# Altium project copper_suicide.PrjPCB (part 2 of 5)

## Sheet fpga-bank1.SchDoc: Copper Suicide - FPGA - Bank 1
size Letter; CheckedBy: J. Brinton; CompanyName: Signal Laboratories, Inc.; DrawnBy: J. Brinton; Engineer: J. Brinton; Address1: 3479 Edison Way; Address2: Menlo Park CA 94025; Address3: +1 (877) 778-8435; Address4: siglabs.com; Revision: 3; SheetNumber: 6; SheetTotal: 47
Used 17 times, as channels FPGA01/FPGA1B, FPGA02/FPGA1B, FPGA03/FPGA1B, FPGA30/FPGA1B, FPGA31/FPGA1B, FPGA32/FPGA1B, FPGA33/FPGA1B, FPGA10/FPGA1B, FPGA11/FPGA1B, FPGA12/FPGA1B, FPGA13/FPGA1B, FPGA20/FPGA1B, FPGA21/FPGA1B, FPGA22/FPGA1B, FPGA23/FPGA1B, CFG/FPGA1B, FPGA00/FPGA1B. Parts and nets are listed once, with the designators drawn on the sheet.
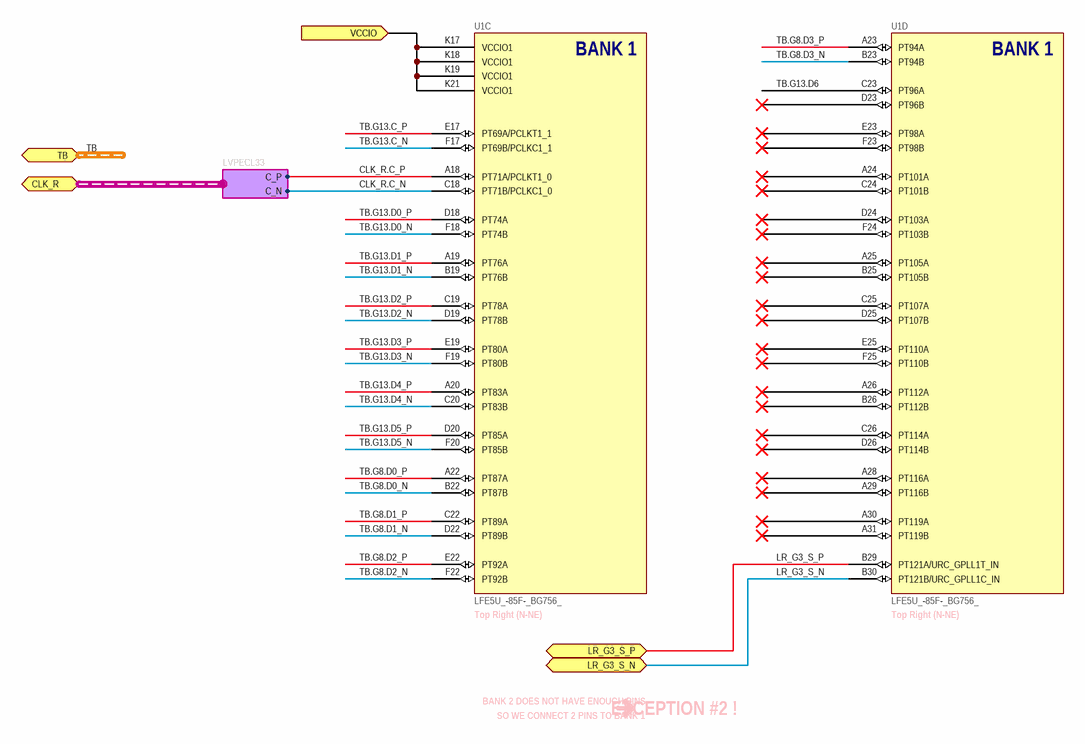
[diagram p3: fpga-bank1.SchDoc]

### Parts
U1  LFE5U_-85F-_BG756_  [caBGA756]  (parts C,D of 19)

### Ports
CLK_R (harness LVPECL33), LR_G3_S_N, LR_G3_S_P, TB (harness SDR), VCCIO (in)

### Harnesses
LVPECL33: C_P, C_N

### Nets
CLK_R.C_N: U1.C18(PT71B/PCLKC1_0) ; port CLK_R.C_N
CLK_R.C_P: U1.A18(PT71A/PCLKT1_0) ; port CLK_R.C_P
LR_G3_S_N: U1.B30(PT121B/URC_GPLL1C_IN) ; port LR_G3_S_N
LR_G3_S_P: U1.B29(PT121A/URC_GPLL1T_IN) ; port LR_G3_S_P
TB.G8.D0_N: U1.B22(PT87B)
TB.G8.D0_P: U1.A22(PT87A)
TB.G8.D1_N: U1.D22(PT89B)
TB.G8.D1_P: U1.C22(PT89A)
TB.G8.D2_N: U1.F22(PT92B)
TB.G8.D2_P: U1.E22(PT92A)
TB.G8.D3_N: U1.B23(PT94B)
TB.G8.D3_P: U1.A23(PT94A)
TB.G13.C_N: U1.F17(PT69B/PCLKC1_1)
TB.G13.C_P: U1.E17(PT69A/PCLKT1_1)
TB.G13.D0_N: U1.F18(PT74B)
TB.G13.D0_P: U1.D18(PT74A)
TB.G13.D1_N: U1.B19(PT76B)
TB.G13.D1_P: U1.A19(PT76A)
TB.G13.D2_N: U1.D19(PT78B)
TB.G13.D2_P: U1.C19(PT78A)
TB.G13.D3_N: U1.F19(PT80B)
TB.G13.D3_P: U1.E19(PT80A)
TB.G13.D4_N: U1.C20(PT83B)
TB.G13.D4_P: U1.A20(PT83A)
TB.G13.D5_N: U1.F20(PT85B)
TB.G13.D5_P: U1.D20(PT85A)
TB.G13.D6: U1.C23(PT96A)
VCCIO: U1.K17(VCCIO1) U1.K18(VCCIO1) U1.K19(VCCIO1) U1.K21(VCCIO1) ; port VCCIO

Not connected (* = marked no-connect by the designer): U1 A24(PT101A)* A25(PT105A)* A26(PT112A)* A28(PT116A)* A29(PT116B)* A30(PT119A)* A31(PT119B)* B25(PT105B)* B26(PT112B)* C24(PT101B)* C25(PT107A)* C26(PT114A)* D23(PT96B)* D24(PT103A)* D25(PT107B)* D26(PT114B)* E23(PT98A)* E25(PT110A)* F23(PT98B)* F24(PT103B)* F25(PT110B)*

### Channels
FPGA01/FPGA1B: designators end in A#2; ports LR_G3_S_N=IL12.LR.G3.S_N_FPGA01 LR_G3_S_P=IL12.LR.G3.S_P_FPGA01 VCCIO=IL12.VIOTB_FPGA01
FPGA02/FPGA1B: designators end in B#2; ports LR_G3_S_N=IL12.LR.G3.S_N_FPGA02 LR_G3_S_P=IL12.LR.G3.S_P_FPGA02 VCCIO=IL12.VIOTB_FPGA02
FPGA03/FPGA1B: designators end in C#2; ports LR_G3_S_N=IL12.LR.G3.S_N_FPGA03 LR_G3_S_P=IL12.LR.G3.S_P_FPGA03 VCCIO=IL12.VIOTB_FPGA03
FPGA30/FPGA1B: designators end in D#2; ports LR_G3_S_N=IL12.LR.G3.S_N_FPGA30 LR_G3_S_P=IL12.LR.G3.S_P_FPGA30 VCCIO=IL12.VIOTB_FPGA30
FPGA31/FPGA1B: designators end in E#2; ports LR_G3_S_N=IL12.LR.G3.S_N_FPGA31 LR_G3_S_P=IL12.LR.G3.S_P_FPGA31 VCCIO=IL12.VIOTB_FPGA31
FPGA32/FPGA1B: designators end in F#2; ports LR_G3_S_N=IL12.LR.G3.S_N_FPGA32 LR_G3_S_P=IL12.LR.G3.S_P_FPGA32 VCCIO=IL12.VIOTB_FPGA32
FPGA33/FPGA1B: designators end in G#2; ports LR_G3_S_N=IL12.LR.G3.S_N_FPGA33 LR_G3_S_P=IL12.LR.G3.S_P_FPGA33 VCCIO=IL12.VIOTB_FPGA33
FPGA10/FPGA1B: designators end in H#2; ports LR_G3_S_N=IL12.LR.G3.S_N_FPGA10 LR_G3_S_P=IL12.LR.G3.S_P_FPGA10 VCCIO=IL12.VIOTB_FPGA10
FPGA11/FPGA1B: designators end in I#2; ports LR_G3_S_N=IL12.LR.G3.S_N_FPGA11 LR_G3_S_P=IL12.LR.G3.S_P_FPGA11 VCCIO=IL12.VIOTB_FPGA11
FPGA12/FPGA1B: designators end in J#2; ports LR_G3_S_N=IL12.LR.G3.S_N_FPGA12 LR_G3_S_P=IL12.LR.G3.S_P_FPGA12 VCCIO=IL12.VIOTB_FPGA12
FPGA13/FPGA1B: designators end in K#2; ports LR_G3_S_N=IL12.LR.G3.S_N_FPGA13 LR_G3_S_P=IL12.LR.G3.S_P_FPGA13 VCCIO=IL12.VIOTB_FPGA13
FPGA20/FPGA1B: designators end in L#2; ports LR_G3_S_N=IL12.LR.G3.S_N_FPGA20 LR_G3_S_P=IL12.LR.G3.S_P_FPGA20 VCCIO=IL12.VIOTB_FPGA20
FPGA21/FPGA1B: designators end in M#2; ports LR_G3_S_N=IL12.LR.G3.S_N_FPGA21 LR_G3_S_P=IL12.LR.G3.S_P_FPGA21 VCCIO=IL12.VIOTB_FPGA21
FPGA22/FPGA1B: designators end in N#2; ports LR_G3_S_N=IL12.LR.G3.S_N_FPGA22 LR_G3_S_P=IL12.LR.G3.S_P_FPGA22 VCCIO=IL12.VIOTB_FPGA22
FPGA23/FPGA1B: designators end in O#2; ports LR_G3_S_N=IL12.LR.G3.S_N_FPGA23 LR_G3_S_P=IL12.LR.G3.S_P_FPGA23 VCCIO=IL12.VIOTB_FPGA23
CFG/FPGA1B: designators end in P#2; ports LR_G3_S_N=IL12.LR.G3.S_N_CFG LR_G3_S_P=IL12.LR.G3.S_P_CFG VCCIO=IL12.VIOTB_CFG
FPGA00/FPGA1B: designators end in Q#2; ports LR_G3_S_N=IL12.LR.G3.S_N_FPGA00 LR_G3_S_P=IL12.LR.G3.S_P_FPGA00 VCCIO=IL12.VIOTB_FPGA00

### Buses and harness runs
harness TB = port TB

### Notes on the sheet
- (near U1) Top Right (N-NE)
- EXCEPTION #2 !
- BANK 2 DOES NOT HAVE ENOUGH PINS
- SO WE CONNECT 2 PINS TO BANK 1
- Title
- Engineer
- Revision
- Drawn By
- Checked By
- Date
- Sheet
- of
- (in symbol LFE5U_-85F-_BG756_, part C) BANK 1
- (in symbol LFE5U_-85F-_BG756_, part D) BANK 1

### Library data of the parts
U1 = LFE5U_-85F-_BG756_: ECP5 FPGA, 85k LUT, 756-caBGA; Manufacturer: Lattice Semiconductor; Manufacturer P/N: LFE5U_-85F-_BG756_

## Sheet fpga-bank2.SchDoc: Copper Suicide - FPGA - Bank 2
size Letter; CheckedBy: J. Brinton; CompanyName: Signal Laboratories, Inc.; DrawnBy: J. Brinton; Engineer: J. Brinton; Address1: 3479 Edison Way; Address2: Menlo Park CA 94025; Address3: +1 (877) 778-8435; Address4: siglabs.com; Revision: 3; SheetNumber: 7; SheetTotal: 47
Used 17 times, as channels FPGA01/FPGA2B, FPGA02/FPGA2B, FPGA03/FPGA2B, FPGA30/FPGA2B, FPGA31/FPGA2B, FPGA32/FPGA2B, FPGA33/FPGA2B, FPGA10/FPGA2B, FPGA11/FPGA2B, FPGA12/FPGA2B, FPGA13/FPGA2B, FPGA20/FPGA2B, FPGA21/FPGA2B, FPGA22/FPGA2B, FPGA23/FPGA2B, CFG/FPGA2B, FPGA00/FPGA2B. Parts and nets are listed once, with the designators drawn on the sheet.
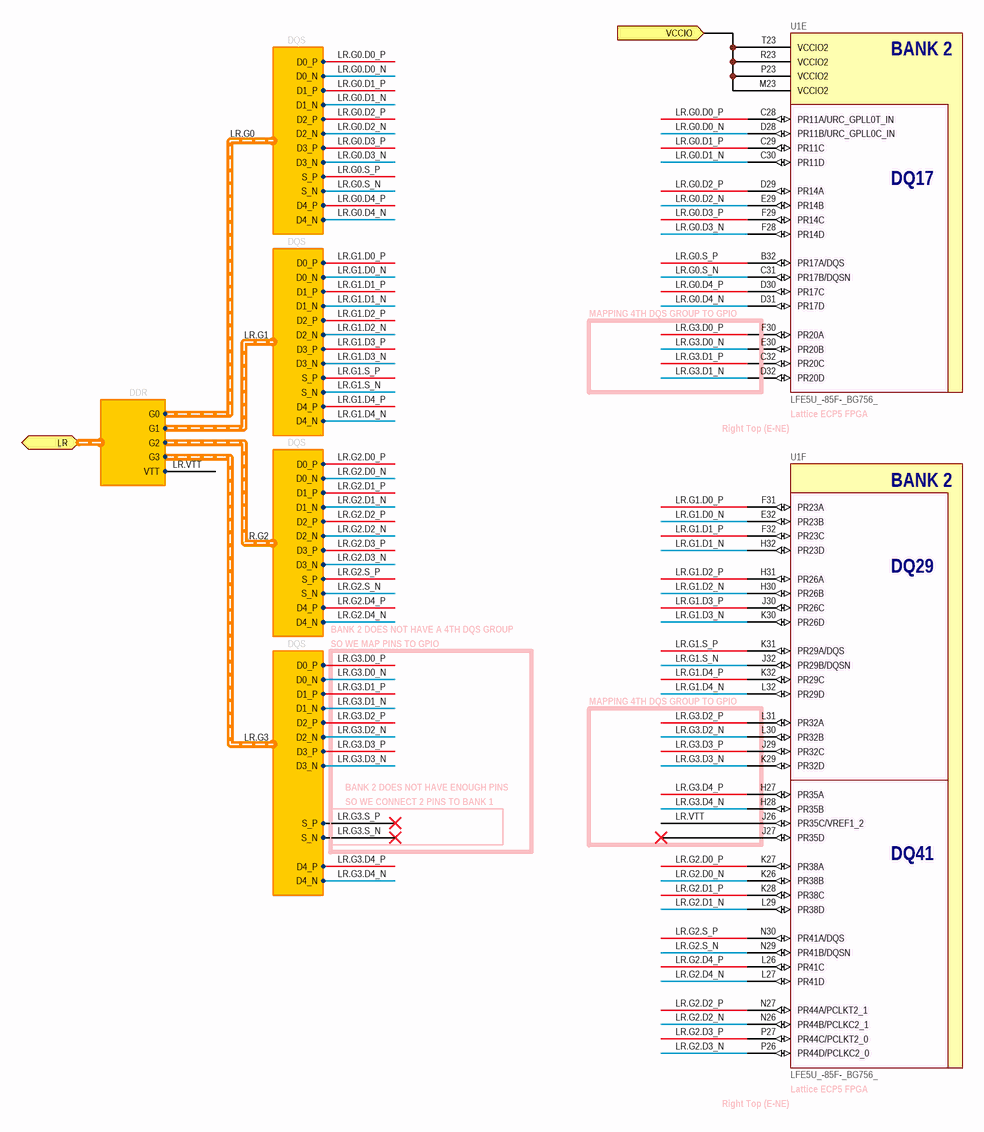
[diagram p4: fpga-bank2.SchDoc]

### Parts
U1  LFE5U_-85F-_BG756_  [caBGA756]  (parts E,F of 19)

### Ports
LR (harness DDR), VCCIO (in)

### Harnesses
DQS: D0_P, D0_N, D1_P, D1_N, D2_P, D2_N, D3_P, D3_N, D4_P, D4_N, S_P, S_N
DDR: G0, G1, G2, G3, VTT

### Nets
LR.G0.D0_N: U1.D28(PR11B/URC_GPLL0C_IN) ; harness DQS.D0_N
LR.G0.D0_P: U1.C28(PR11A/URC_GPLL0T_IN) ; harness DQS.D0_P
LR.G0.D1_N: U1.C30(PR11D) ; harness DQS.D1_N
LR.G0.D1_P: U1.C29(PR11C) ; harness DQS.D1_P
LR.G0.D2_N: U1.E29(PR14B) ; harness DQS.D2_N
LR.G0.D2_P: U1.D29(PR14A) ; harness DQS.D2_P
LR.G0.D3_N: U1.F28(PR14D) ; harness DQS.D3_N
LR.G0.D3_P: U1.F29(PR14C) ; harness DQS.D3_P
LR.G0.D4_N: U1.D31(PR17D) ; harness DQS.D4_N
LR.G0.D4_P: U1.D30(PR17C) ; harness DQS.D4_P
LR.G0.S_N: U1.C31(PR17B/DQSN) ; harness DQS.S_N
LR.G0.S_P: U1.B32(PR17A/DQS) ; harness DQS.S_P
LR.G1.D0_N: U1.E32(PR23B) ; harness DQS.D0_N
LR.G1.D0_P: U1.F31(PR23A) ; harness DQS.D0_P
LR.G1.D1_N: U1.H32(PR23D) ; harness DQS.D1_N
LR.G1.D1_P: U1.F32(PR23C) ; harness DQS.D1_P
LR.G1.D2_N: U1.H30(PR26B) ; harness DQS.D2_N
LR.G1.D2_P: U1.H31(PR26A) ; harness DQS.D2_P
LR.G1.D3_N: U1.K30(PR26D) ; harness DQS.D3_N
LR.G1.D3_P: U1.J30(PR26C) ; harness DQS.D3_P
LR.G1.D4_N: U1.L32(PR29D) ; harness DQS.D4_N
LR.G1.D4_P: U1.K32(PR29C) ; harness DQS.D4_P
LR.G1.S_N: U1.J32(PR29B/DQSN) ; harness DQS.S_N
LR.G1.S_P: U1.K31(PR29A/DQS) ; harness DQS.S_P
LR.G2.D0_N: U1.K26(PR38B) ; harness DQS.D0_N
LR.G2.D0_P: U1.K27(PR38A) ; harness DQS.D0_P
LR.G2.D1_N: U1.L29(PR38D) ; harness DQS.D1_N
LR.G2.D1_P: U1.K28(PR38C) ; harness DQS.D1_P
LR.G2.D2_N: U1.N26(PR44B/PCLKC2_1) ; harness DQS.D2_N
LR.G2.D2_P: U1.N27(PR44A/PCLKT2_1) ; harness DQS.D2_P
LR.G2.D3_N: U1.P26(PR44D/PCLKC2_0) ; harness DQS.D3_N
LR.G2.D3_P: U1.P27(PR44C/PCLKT2_0) ; harness DQS.D3_P
LR.G2.D4_N: U1.L27(PR41D) ; harness DQS.D4_N
LR.G2.D4_P: U1.L26(PR41C) ; harness DQS.D4_P
LR.G2.S_N: U1.N29(PR41B/DQSN) ; harness DQS.S_N
LR.G2.S_P: U1.N30(PR41A/DQS) ; harness DQS.S_P
LR.G3.D0_N: U1.E30(PR20B) ; harness DQS.D0_N
LR.G3.D0_P: U1.F30(PR20A) ; harness DQS.D0_P
LR.G3.D1_N: U1.D32(PR20D) ; harness DQS.D1_N
LR.G3.D1_P: U1.C32(PR20C) ; harness DQS.D1_P
LR.G3.D2_N: U1.L30(PR32B) ; harness DQS.D2_N
LR.G3.D2_P: U1.L31(PR32A) ; harness DQS.D2_P
LR.G3.D3_N: U1.K29(PR32D) ; harness DQS.D3_N
LR.G3.D3_P: U1.J29(PR32C) ; harness DQS.D3_P
LR.G3.D4_N: U1.H28(PR35B) ; harness DQS.D4_N
LR.G3.D4_P: U1.H27(PR35A) ; harness DQS.D4_P
LR.G3.S_N: harness DQS.S_N
LR.G3.S_P: harness DQS.S_P
LR.VTT: U1.J26(PR35C/VREF1_2) ; port LR.VTT
VCCIO: U1.M23(VCCIO2) U1.P23(VCCIO2) U1.R23(VCCIO2) U1.T23(VCCIO2) ; port VCCIO

Not connected (* = marked no-connect by the designer): U1 J27(PR35D)*

### Channels
FPGA01/FPGA2B: designators end in A#3; ports VCCIO=IL12.VIOLR_FPGA01
FPGA02/FPGA2B: designators end in B#3; ports VCCIO=IL12.VIOLR_FPGA02
FPGA03/FPGA2B: designators end in C#3; ports VCCIO=IL12.VIOLR_FPGA03
FPGA30/FPGA2B: designators end in D#3; ports VCCIO=IL12.VIOLR_FPGA30
FPGA31/FPGA2B: designators end in E#3; ports VCCIO=IL12.VIOLR_FPGA31
FPGA32/FPGA2B: designators end in F#3; ports VCCIO=IL12.VIOLR_FPGA32
FPGA33/FPGA2B: designators end in G#3; ports VCCIO=IL12.VIOLR_FPGA33
FPGA10/FPGA2B: designators end in H#3; ports VCCIO=IL12.VIOLR_FPGA10
FPGA11/FPGA2B: designators end in I#3; ports VCCIO=IL12.VIOLR_FPGA11
FPGA12/FPGA2B: designators end in J#3; ports VCCIO=IL12.VIOLR_FPGA12
FPGA13/FPGA2B: designators end in K#3; ports VCCIO=IL12.VIOLR_FPGA13
FPGA20/FPGA2B: designators end in L#3; ports VCCIO=IL12.VIOLR_FPGA20
FPGA21/FPGA2B: designators end in M#3; ports VCCIO=IL12.VIOLR_FPGA21
FPGA22/FPGA2B: designators end in N#3; ports VCCIO=IL12.VIOLR_FPGA22
FPGA23/FPGA2B: designators end in O#3; ports VCCIO=IL12.VIOLR_FPGA23
CFG/FPGA2B: designators end in P#3; ports VCCIO=IL12.VIOLR_CFG
FPGA00/FPGA2B: designators end in Q#3; ports VCCIO=IL12.VIOLR_FPGA00

### Notes on the sheet
- (near U1) MAPPING 4TH DQS GROUP TO GPIO
- (near U1) Right Top (E-NE)
- (near U1) Lattice ECP5 FPGA
- BANK 2 DOES NOT HAVE A 4TH DQS GROUP
- SO WE MAP PINS TO GPIO
- BANK 2 DOES NOT HAVE ENOUGH PINS
- SO WE CONNECT 2 PINS TO BANK 1
- Title
- Engineer
- Revision
- Drawn By
- Checked By
- Date
- Sheet
- of
- (in symbol LFE5U_-85F-_BG756_, part E) BANK 2; DQ17
- (in symbol LFE5U_-85F-_BG756_, part F) BANK 2; DQ29; DQ41

### Library data of the parts
U1 = LFE5U_-85F-_BG756_: as U1 on sheet fpga-bank1; Manufacturer P/N: LFE5U_-85F-_BG756_

## Sheet fpga-bank3.SchDoc: Copper Suicide - FPGA - Bank 3
size Letter; CheckedBy: J. Brinton; CompanyName: Signal Laboratories, Inc.; DrawnBy: J. Brinton; Engineer: J. Brinton; Address1: 3479 Edison Way; Address2: Menlo Park CA 94025; Address3: +1 (877) 778-8435; Address4: siglabs.com; Revision: 3; SheetNumber: 8; SheetTotal: 47
Used 17 times, as channels FPGA01/FPGA3B, FPGA02/FPGA3B, FPGA03/FPGA3B, FPGA30/FPGA3B, FPGA31/FPGA3B, FPGA32/FPGA3B, FPGA33/FPGA3B, FPGA10/FPGA3B, FPGA11/FPGA3B, FPGA12/FPGA3B, FPGA13/FPGA3B, FPGA20/FPGA3B, FPGA21/FPGA3B, FPGA22/FPGA3B, FPGA23/FPGA3B, CFG/FPGA3B, FPGA00/FPGA3B. Parts and nets are listed once, with the designators drawn on the sheet.
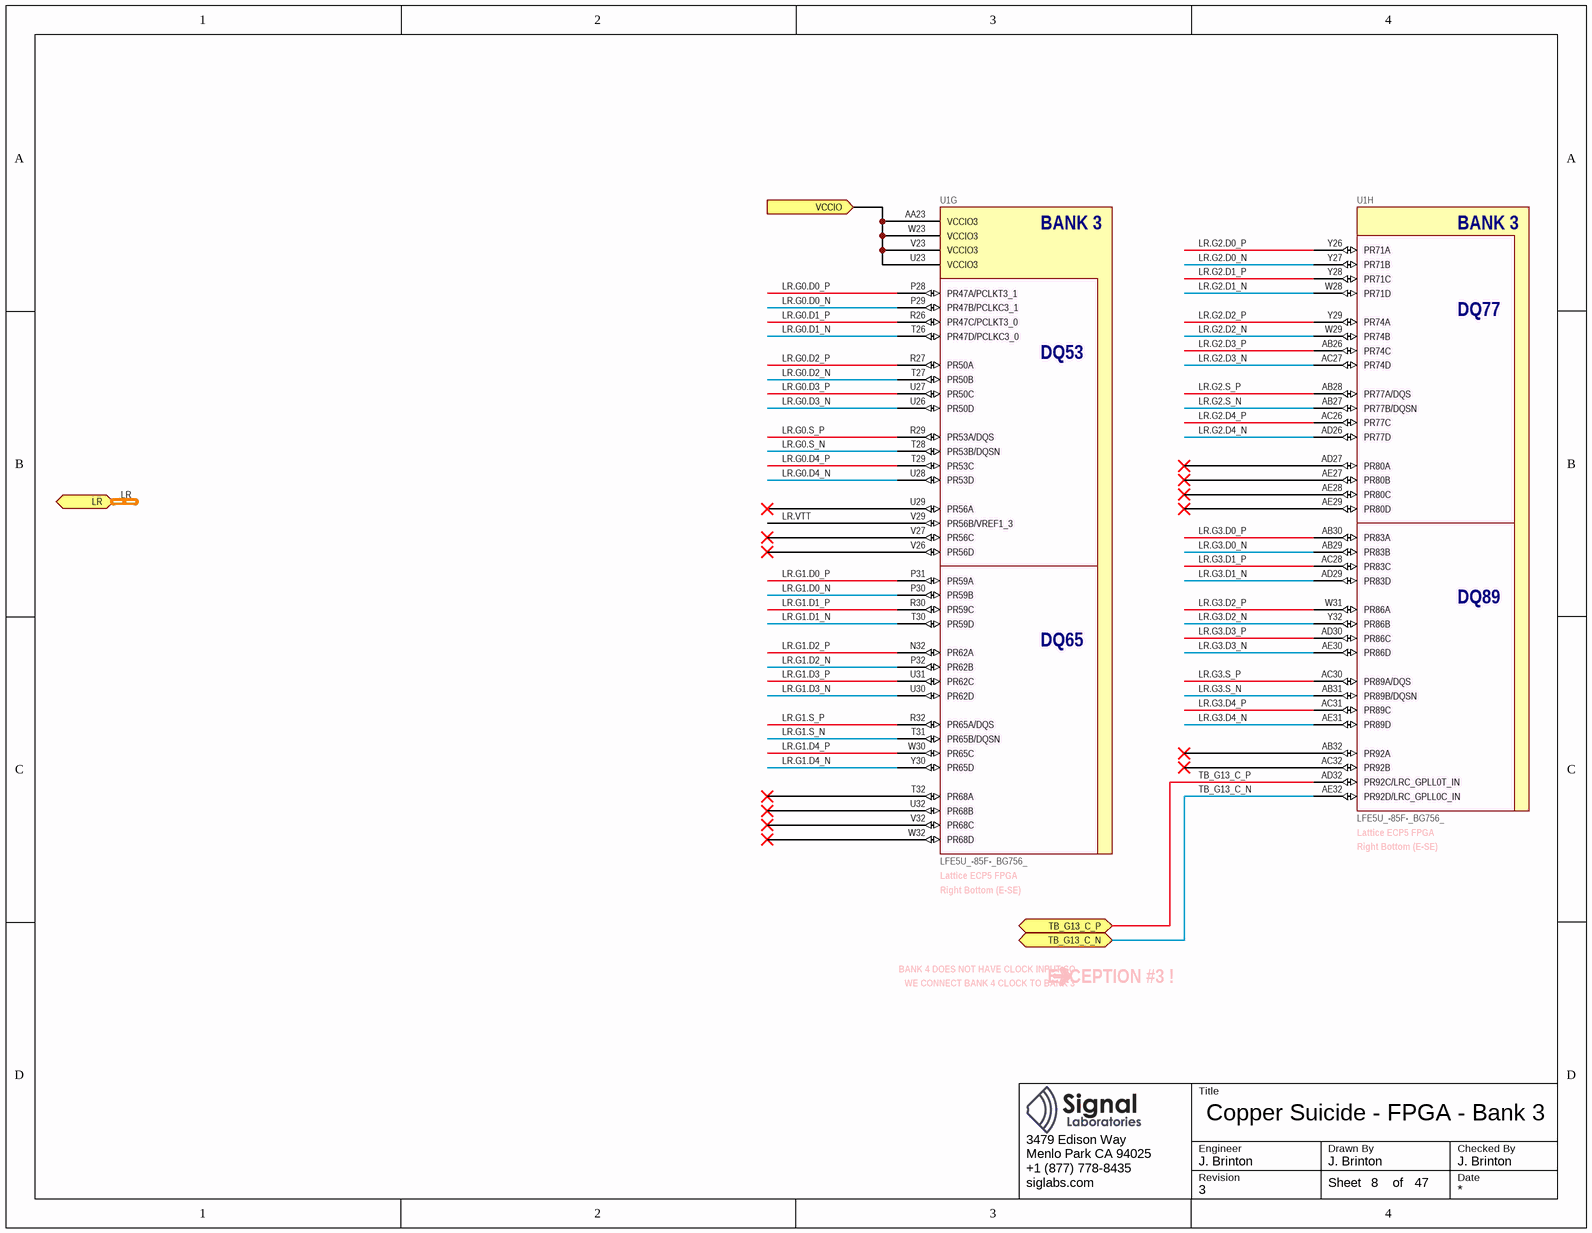
[diagram p5: fpga-bank3.SchDoc]

### Parts
U1  LFE5U_-85F-_BG756_  [caBGA756]  (parts G,H of 19)

### Ports
LR (harness DDR), TB_G13_C_N, TB_G13_C_P, VCCIO (in)

### Nets
LR.G0.D0_N: U1.P29(PR47B/PCLKC3_1)
LR.G0.D0_P: U1.P28(PR47A/PCLKT3_1)
LR.G0.D1_N: U1.T26(PR47D/PCLKC3_0)
LR.G0.D1_P: U1.R26(PR47C/PCLKT3_0)
LR.G0.D2_N: U1.T27(PR50B)
LR.G0.D2_P: U1.R27(PR50A)
LR.G0.D3_N: U1.U26(PR50D)
LR.G0.D3_P: U1.U27(PR50C)
LR.G0.D4_N: U1.U28(PR53D)
LR.G0.D4_P: U1.T29(PR53C)
LR.G0.S_N: U1.T28(PR53B/DQSN)
LR.G0.S_P: U1.R29(PR53A/DQS)
LR.G1.D0_N: U1.P30(PR59B)
LR.G1.D0_P: U1.P31(PR59A)
LR.G1.D1_N: U1.T30(PR59D)
LR.G1.D1_P: U1.R30(PR59C)
LR.G1.D2_N: U1.P32(PR62B)
LR.G1.D2_P: U1.N32(PR62A)
LR.G1.D3_N: U1.U30(PR62D)
LR.G1.D3_P: U1.U31(PR62C)
LR.G1.D4_N: U1.Y30(PR65D)
LR.G1.D4_P: U1.W30(PR65C)
LR.G1.S_N: U1.T31(PR65B/DQSN)
LR.G1.S_P: U1.R32(PR65A/DQS)
LR.G2.D0_N: U1.Y27(PR71B)
LR.G2.D0_P: U1.Y26(PR71A)
LR.G2.D1_N: U1.W28(PR71D)
LR.G2.D1_P: U1.Y28(PR71C)
LR.G2.D2_N: U1.W29(PR74B)
LR.G2.D2_P: U1.Y29(PR74A)
LR.G2.D3_N: U1.AC27(PR74D)
LR.G2.D3_P: U1.AB26(PR74C)
LR.G2.D4_N: U1.AD26(PR77D)
LR.G2.D4_P: U1.AC26(PR77C)
LR.G2.S_N: U1.AB27(PR77B/DQSN)
LR.G2.S_P: U1.AB28(PR77A/DQS)
LR.G3.D0_N: U1.AB29(PR83B)
LR.G3.D0_P: U1.AB30(PR83A)
LR.G3.D1_N: U1.AD29(PR83D)
LR.G3.D1_P: U1.AC28(PR83C)
LR.G3.D2_N: U1.Y32(PR86B)
LR.G3.D2_P: U1.W31(PR86A)
LR.G3.D3_N: U1.AE30(PR86D)
LR.G3.D3_P: U1.AD30(PR86C)
LR.G3.D4_N: U1.AE31(PR89D)
LR.G3.D4_P: U1.AC31(PR89C)
LR.G3.S_N: U1.AB31(PR89B/DQSN)
LR.G3.S_P: U1.AC30(PR89A/DQS)
LR.VTT: U1.V29(PR56B/VREF1_3)
TB_G13_C_N: U1.AE32(PR92D/LRC_GPLL0C_IN) ; port TB_G13_C_N
TB_G13_C_P: U1.AD32(PR92C/LRC_GPLL0T_IN) ; port TB_G13_C_P
VCCIO: U1.AA23(VCCIO3) U1.U23(VCCIO3) U1.V23(VCCIO3) U1.W23(VCCIO3) ; port VCCIO

Not connected (* = marked no-connect by the designer): U1 AB32(PR92A)* AC32(PR92B)* AD27(PR80A)* AE27(PR80B)* AE28(PR80C)* AE29(PR80D)* T32(PR68A)* U29(PR56A)* U32(PR68B)* V26(PR56D)* V27(PR56C)* V32(PR68C)* W32(PR68D)*

### Channels
FPGA01/FPGA3B: designators end in A#4; ports TB_G13_C_N=IL34.TB.G13.C_N_FPGA01 TB_G13_C_P=IL34.TB.G13.C_P_FPGA01 VCCIO=IL34.VIOLR_FPGA01
FPGA02/FPGA3B: designators end in B#4; ports TB_G13_C_N=IL34.TB.G13.C_N_FPGA02 TB_G13_C_P=IL34.TB.G13.C_P_FPGA02 VCCIO=IL34.VIOLR_FPGA02
FPGA03/FPGA3B: designators end in C#4; ports TB_G13_C_N=IL34.TB.G13.C_N_FPGA03 TB_G13_C_P=IL34.TB.G13.C_P_FPGA03 VCCIO=IL34.VIOLR_FPGA03
FPGA30/FPGA3B: designators end in D#4; ports TB_G13_C_N=IL34.TB.G13.C_N_FPGA30 TB_G13_C_P=IL34.TB.G13.C_P_FPGA30 VCCIO=IL34.VIOLR_FPGA30
FPGA31/FPGA3B: designators end in E#4; ports TB_G13_C_N=IL34.TB.G13.C_N_FPGA31 TB_G13_C_P=IL34.TB.G13.C_P_FPGA31 VCCIO=IL34.VIOLR_FPGA31
FPGA32/FPGA3B: designators end in F#4; ports TB_G13_C_N=IL34.TB.G13.C_N_FPGA32 TB_G13_C_P=IL34.TB.G13.C_P_FPGA32 VCCIO=IL34.VIOLR_FPGA32
FPGA33/FPGA3B: designators end in G#4; ports TB_G13_C_N=IL34.TB.G13.C_N_FPGA33 TB_G13_C_P=IL34.TB.G13.C_P_FPGA33 VCCIO=IL34.VIOLR_FPGA33
FPGA10/FPGA3B: designators end in H#4; ports TB_G13_C_N=IL34.TB.G13.C_N_FPGA10 TB_G13_C_P=IL34.TB.G13.C_P_FPGA10 VCCIO=IL34.VIOLR_FPGA10
FPGA11/FPGA3B: designators end in I#4; ports TB_G13_C_N=IL34.TB.G13.C_N_FPGA11 TB_G13_C_P=IL34.TB.G13.C_P_FPGA11 VCCIO=IL34.VIOLR_FPGA11
FPGA12/FPGA3B: designators end in J#4; ports TB_G13_C_N=IL34.TB.G13.C_N_FPGA12 TB_G13_C_P=IL34.TB.G13.C_P_FPGA12 VCCIO=IL34.VIOLR_FPGA12
FPGA13/FPGA3B: designators end in K#4; ports TB_G13_C_N=IL34.TB.G13.C_N_FPGA13 TB_G13_C_P=IL34.TB.G13.C_P_FPGA13 VCCIO=IL34.VIOLR_FPGA13
FPGA20/FPGA3B: designators end in L#4; ports TB_G13_C_N=IL34.TB.G13.C_N_FPGA20 TB_G13_C_P=IL34.TB.G13.C_P_FPGA20 VCCIO=IL34.VIOLR_FPGA20
FPGA21/FPGA3B: designators end in M#4; ports TB_G13_C_N=IL34.TB.G13.C_N_FPGA21 TB_G13_C_P=IL34.TB.G13.C_P_FPGA21 VCCIO=IL34.VIOLR_FPGA21
FPGA22/FPGA3B: designators end in N#4; ports TB_G13_C_N=IL34.TB.G13.C_N_FPGA22 TB_G13_C_P=IL34.TB.G13.C_P_FPGA22 VCCIO=IL34.VIOLR_FPGA22
FPGA23/FPGA3B: designators end in O#4; ports TB_G13_C_N=IL34.TB.G13.C_N_FPGA23 TB_G13_C_P=IL34.TB.G13.C_P_FPGA23 VCCIO=IL34.VIOLR_FPGA23
CFG/FPGA3B: designators end in P#4; ports TB_G13_C_N=IL34.TB.G13.C_N_CFG TB_G13_C_P=IL34.TB.G13.C_P_CFG VCCIO=IL34.VIOLR_CFG
FPGA00/FPGA3B: designators end in Q#4; ports TB_G13_C_N=IL34.TB.G13.C_N_FPGA00 TB_G13_C_P=IL34.TB.G13.C_P_FPGA00 VCCIO=IL34.VIOLR_FPGA00

### Buses and harness runs
harness LR = port LR

### Notes on the sheet
- (near U1) Right Bottom (E-SE)
- (near U1) Lattice ECP5 FPGA
- EXCEPTION #3 !
- BANK 4 DOES NOT HAVE CLOCK INPUT SO
- WE CONNECT BANK 4 CLOCK TO BANK 3
- Title
- Engineer
- Revision
- Drawn By
- Checked By
- Date
- Sheet
- of
- (in symbol LFE5U_-85F-_BG756_, part G) BANK 3; DQ53; DQ65
- (in symbol LFE5U_-85F-_BG756_, part H) BANK 3; DQ77; DQ89

### Library data of the parts
U1 = LFE5U_-85F-_BG756_: as U1 on sheet fpga-bank1; Manufacturer P/N: LFE5U_-85F-_BG756_

## Sheet fpga-bank4.SchDoc: Copper Suicide - FPGA - Bank 4
size Letter; CheckedBy: J. Brinton; CompanyName: Signal Laboratories, Inc.; DrawnBy: J. Brinton; Engineer: J. Brinton; Address1: 3479 Edison Way; Address2: Menlo Park CA 94025; Address3: +1 (877) 778-8435; Address4: siglabs.com; Revision: 3; SheetNumber: 9; SheetTotal: 47
Used 17 times, as channels FPGA01/FPGA4B, FPGA02/FPGA4B, FPGA03/FPGA4B, FPGA30/FPGA4B, FPGA31/FPGA4B, FPGA32/FPGA4B, FPGA33/FPGA4B, FPGA10/FPGA4B, FPGA11/FPGA4B, FPGA12/FPGA4B, FPGA13/FPGA4B, FPGA20/FPGA4B, FPGA21/FPGA4B, FPGA22/FPGA4B, FPGA23/FPGA4B, CFG/FPGA4B, FPGA00/FPGA4B. Parts and nets are listed once, with the designators drawn on the sheet.
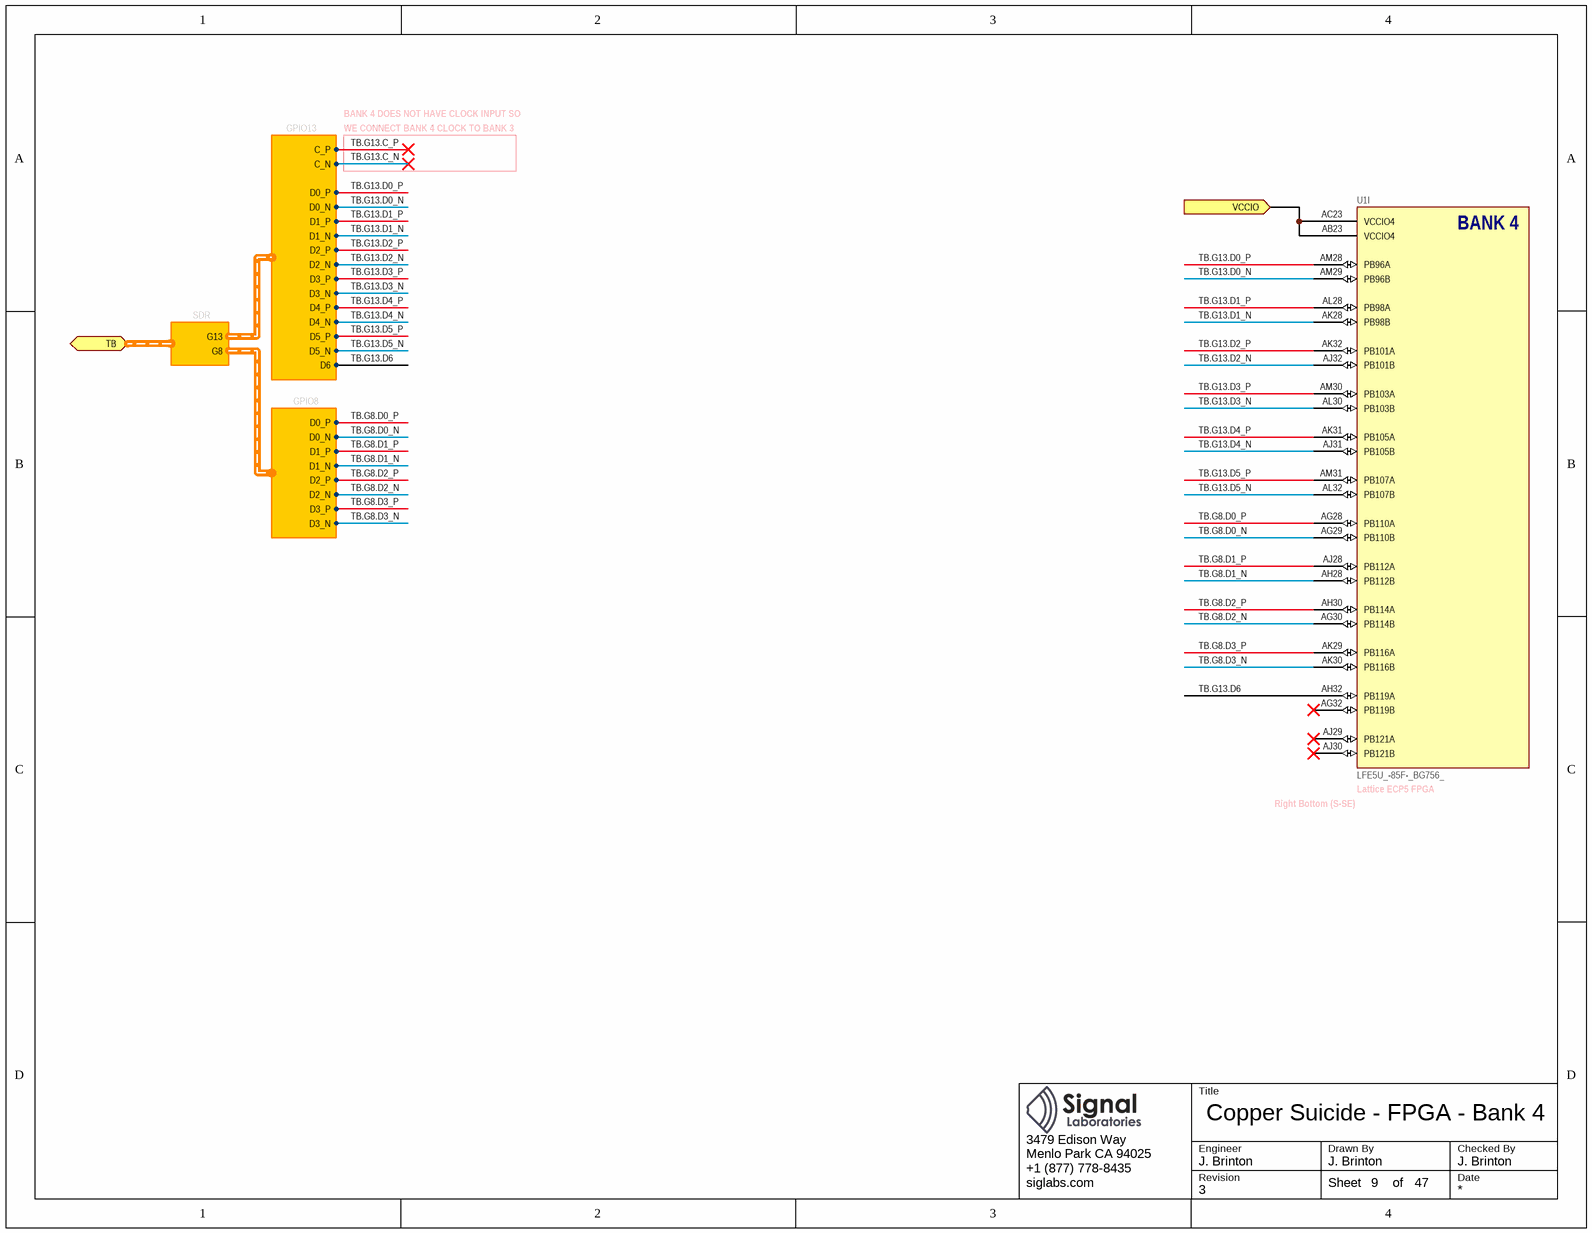
[diagram p6: fpga-bank4.SchDoc]

### Parts
U1  LFE5U_-85F-_BG756_  [caBGA756]  (part I of 19)

### Ports
TB (harness SDR), VCCIO (in)

### Harnesses
SDR: G13, G8
GPIO13: C_P, C_N, D0_P, D0_N, D1_P, D1_N, D2_P, D2_N, D3_P, D3_N, D4_P, D4_N, D5_P, D5_N, D6
GPIO8: D0_P, D0_N, D1_P, D1_N, D2_P, D2_N, D3_P, D3_N

### Nets
TB.G8.D0_N: U1.AG29(PB110B) ; harness GPIO8.D0_N
TB.G8.D0_P: U1.AG28(PB110A) ; harness GPIO8.D0_P
TB.G8.D1_N: U1.AH28(PB112B) ; harness GPIO8.D1_N
TB.G8.D1_P: U1.AJ28(PB112A) ; harness GPIO8.D1_P
TB.G8.D2_N: U1.AG30(PB114B) ; harness GPIO8.D2_N
TB.G8.D2_P: U1.AH30(PB114A) ; harness GPIO8.D2_P
TB.G8.D3_N: U1.AK30(PB116B) ; harness GPIO8.D3_N
TB.G8.D3_P: U1.AK29(PB116A) ; harness GPIO8.D3_P
TB.G13.C_N: harness GPIO13.C_N
TB.G13.C_P: harness GPIO13.C_P
TB.G13.D0_N: U1.AM29(PB96B) ; harness GPIO13.D0_N
TB.G13.D0_P: U1.AM28(PB96A) ; harness GPIO13.D0_P
TB.G13.D1_N: U1.AK28(PB98B) ; harness GPIO13.D1_N
TB.G13.D1_P: U1.AL28(PB98A) ; harness GPIO13.D1_P
TB.G13.D2_N: U1.AJ32(PB101B) ; harness GPIO13.D2_N
TB.G13.D2_P: U1.AK32(PB101A) ; harness GPIO13.D2_P
TB.G13.D3_N: U1.AL30(PB103B) ; harness GPIO13.D3_N
TB.G13.D3_P: U1.AM30(PB103A) ; harness GPIO13.D3_P
TB.G13.D4_N: U1.AJ31(PB105B) ; harness GPIO13.D4_N
TB.G13.D4_P: U1.AK31(PB105A) ; harness GPIO13.D4_P
TB.G13.D5_N: U1.AL32(PB107B) ; harness GPIO13.D5_N
TB.G13.D5_P: U1.AM31(PB107A) ; harness GPIO13.D5_P
TB.G13.D6: U1.AH32(PB119A) ; harness GPIO13.D6
VCCIO: U1.AB23(VCCIO4) U1.AC23(VCCIO4) ; port VCCIO

Not connected (* = marked no-connect by the designer): U1 AG32(PB119B)* AJ29(PB121A)* AJ30(PB121B)*

### Channels
FPGA01/FPGA4B: designators end in A#5; ports VCCIO=IL34.VIOTB_FPGA01
FPGA02/FPGA4B: designators end in B#5; ports VCCIO=IL34.VIOTB_FPGA02
FPGA03/FPGA4B: designators end in C#5; ports VCCIO=IL34.VIOTB_FPGA03
FPGA30/FPGA4B: designators end in D#5; ports VCCIO=IL34.VIOTB_FPGA30
FPGA31/FPGA4B: designators end in E#5; ports VCCIO=IL34.VIOTB_FPGA31
FPGA32/FPGA4B: designators end in F#5; ports VCCIO=IL34.VIOTB_FPGA32
FPGA33/FPGA4B: designators end in G#5; ports VCCIO=IL34.VIOTB_FPGA33
FPGA10/FPGA4B: designators end in H#5; ports VCCIO=IL34.VIOTB_FPGA10
FPGA11/FPGA4B: designators end in I#5; ports VCCIO=IL34.VIOTB_FPGA11
FPGA12/FPGA4B: designators end in J#5; ports VCCIO=IL34.VIOTB_FPGA12
FPGA13/FPGA4B: designators end in K#5; ports VCCIO=IL34.VIOTB_FPGA13
FPGA20/FPGA4B: designators end in L#5; ports VCCIO=IL34.VIOTB_FPGA20
FPGA21/FPGA4B: designators end in M#5; ports VCCIO=IL34.VIOTB_FPGA21
FPGA22/FPGA4B: designators end in N#5; ports VCCIO=IL34.VIOTB_FPGA22
FPGA23/FPGA4B: designators end in O#5; ports VCCIO=IL34.VIOTB_FPGA23
CFG/FPGA4B: designators end in P#5; ports VCCIO=IL34.VIOTB_CFG
FPGA00/FPGA4B: designators end in Q#5; ports VCCIO=IL34.VIOTB_FPGA00

### Notes on the sheet
- BANK 4 DOES NOT HAVE CLOCK INPUT SO
- WE CONNECT BANK 4 CLOCK TO BANK 3
- (near U1) Right Bottom (S-SE)
- (near U1) Lattice ECP5 FPGA
- Title
- Engineer
- Revision
- Drawn By
- Checked By
- Date
- Sheet
- of
- (in symbol LFE5U_-85F-_BG756_, part I) BANK 4

### Library data of the parts
U1 = LFE5U_-85F-_BG756_: as U1 on sheet fpga-bank1; Manufacturer P/N: LFE5U_-85F-_BG756_

## Sheet fpga-bank6.SchDoc: Copper Suicide - FPGA - Bank 6
size Letter; CheckedBy: J. Brinton; CompanyName: Signal Laboratories, Inc.; DrawnBy: J. Brinton; Engineer: J. Brinton; Address1: 3479 Edison Way; Address2: Menlo Park CA 94025; Address3: +1 (877) 778-8435; Address4: siglabs.com; Revision: 3; SheetNumber: 10; SheetTotal: 47
Used 17 times, as channels FPGA01/FPGA6B, FPGA02/FPGA6B, FPGA03/FPGA6B, FPGA30/FPGA6B, FPGA31/FPGA6B, FPGA32/FPGA6B, FPGA33/FPGA6B, FPGA10/FPGA6B, FPGA11/FPGA6B, FPGA12/FPGA6B, FPGA13/FPGA6B, FPGA20/FPGA6B, FPGA21/FPGA6B, FPGA22/FPGA6B, FPGA23/FPGA6B, CFG/FPGA6B, FPGA00/FPGA6B. Parts and nets are listed once, with the designators drawn on the sheet.
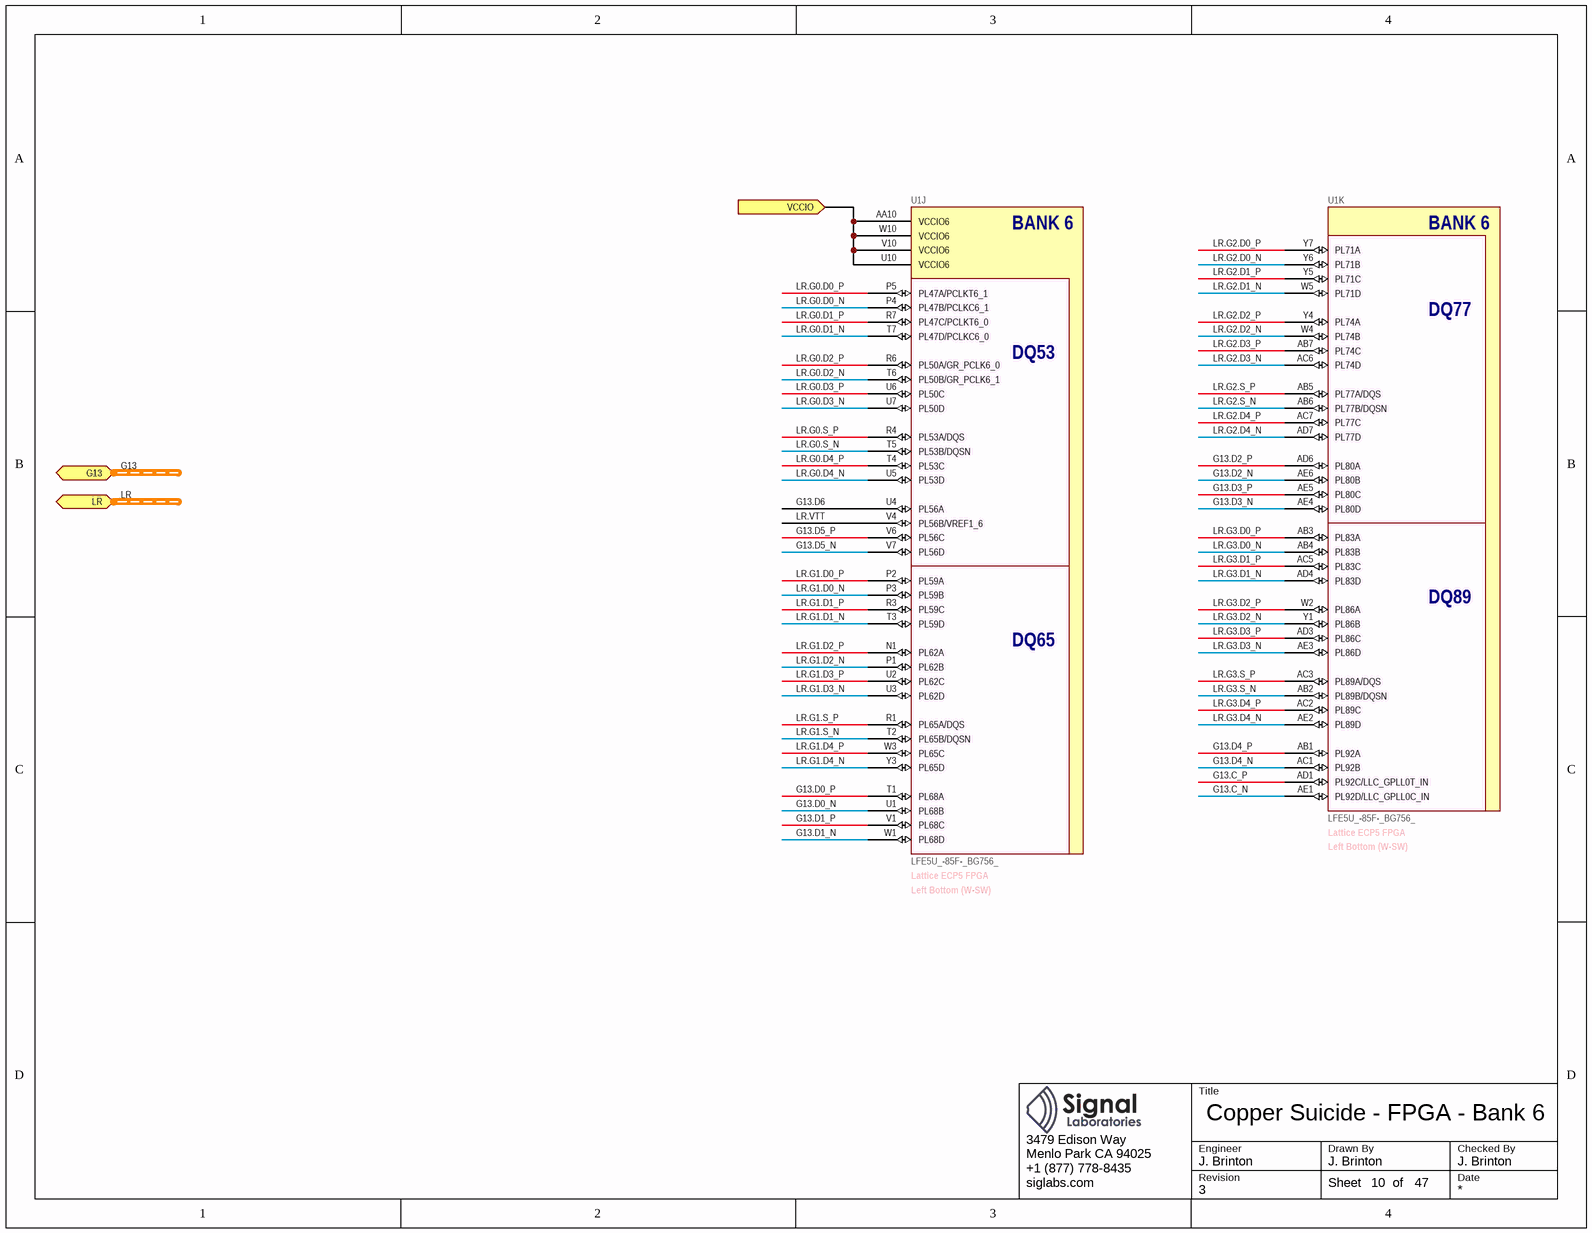
[diagram p7: fpga-bank6.SchDoc]

### Parts
U1  LFE5U_-85F-_BG756_  [caBGA756]  (parts J,K of 19)

### Ports
G13 (harness GPIO13), LR (harness DDR), VCCIO (in)

### Nets
G13.C_N: U1.AE1(PL92D/LLC_GPLL0C_IN)
G13.C_P: U1.AD1(PL92C/LLC_GPLL0T_IN)
G13.D0_N: U1.U1(PL68B)
G13.D0_P: U1.T1(PL68A)
G13.D1_N: U1.W1(PL68D)
G13.D1_P: U1.V1(PL68C)
G13.D2_N: U1.AE6(PL80B)
G13.D2_P: U1.AD6(PL80A)
G13.D3_N: U1.AE4(PL80D)
G13.D3_P: U1.AE5(PL80C)
G13.D4_N: U1.AC1(PL92B)
G13.D4_P: U1.AB1(PL92A)
G13.D5_N: U1.V7(PL56D)
G13.D5_P: U1.V6(PL56C)
G13.D6: U1.U4(PL56A)
LR.G0.D0_N: U1.P4(PL47B/PCLKC6_1)
LR.G0.D0_P: U1.P5(PL47A/PCLKT6_1)
LR.G0.D1_N: U1.T7(PL47D/PCLKC6_0)
LR.G0.D1_P: U1.R7(PL47C/PCLKT6_0)
LR.G0.D2_N: U1.T6(PL50B/GR_PCLK6_1)
LR.G0.D2_P: U1.R6(PL50A/GR_PCLK6_0)
LR.G0.D3_N: U1.U7(PL50D)
LR.G0.D3_P: U1.U6(PL50C)
LR.G0.D4_N: U1.U5(PL53D)
LR.G0.D4_P: U1.T4(PL53C)
LR.G0.S_N: U1.T5(PL53B/DQSN)
LR.G0.S_P: U1.R4(PL53A/DQS)
LR.G1.D0_N: U1.P3(PL59B)
LR.G1.D0_P: U1.P2(PL59A)
LR.G1.D1_N: U1.T3(PL59D)
LR.G1.D1_P: U1.R3(PL59C)
LR.G1.D2_N: U1.P1(PL62B)
LR.G1.D2_P: U1.N1(PL62A)
LR.G1.D3_N: U1.U3(PL62D)
LR.G1.D3_P: U1.U2(PL62C)
LR.G1.D4_N: U1.Y3(PL65D)
LR.G1.D4_P: U1.W3(PL65C)
LR.G1.S_N: U1.T2(PL65B/DQSN)
LR.G1.S_P: U1.R1(PL65A/DQS)
LR.G2.D0_N: U1.Y6(PL71B)
LR.G2.D0_P: U1.Y7(PL71A)
LR.G2.D1_N: U1.W5(PL71D)
LR.G2.D1_P: U1.Y5(PL71C)
LR.G2.D2_N: U1.W4(PL74B)
LR.G2.D2_P: U1.Y4(PL74A)
LR.G2.D3_N: U1.AC6(PL74D)
LR.G2.D3_P: U1.AB7(PL74C)
LR.G2.D4_N: U1.AD7(PL77D)
LR.G2.D4_P: U1.AC7(PL77C)
LR.G2.S_N: U1.AB6(PL77B/DQSN)
LR.G2.S_P: U1.AB5(PL77A/DQS)
LR.G3.D0_N: U1.AB4(PL83B)
LR.G3.D0_P: U1.AB3(PL83A)
LR.G3.D1_N: U1.AD4(PL83D)
LR.G3.D1_P: U1.AC5(PL83C)
LR.G3.D2_N: U1.Y1(PL86B)
LR.G3.D2_P: U1.W2(PL86A)
LR.G3.D3_N: U1.AE3(PL86D)
LR.G3.D3_P: U1.AD3(PL86C)
LR.G3.D4_N: U1.AE2(PL89D)
LR.G3.D4_P: U1.AC2(PL89C)
LR.G3.S_N: U1.AB2(PL89B/DQSN)
LR.G3.S_P: U1.AC3(PL89A/DQS)
LR.VTT: U1.V4(PL56B/VREF1_6)
VCCIO: U1.AA10(VCCIO6) U1.U10(VCCIO6) U1.V10(VCCIO6) U1.W10(VCCIO6) ; port VCCIO

### Channels
FPGA01/FPGA6B: designators end in A#6; ports VCCIO=IL68.VIOLR_FPGA01
FPGA02/FPGA6B: designators end in B#6; ports VCCIO=IL68.VIOLR_FPGA02
FPGA03/FPGA6B: designators end in C#6; ports VCCIO=IL68.VIOLR_FPGA03
FPGA30/FPGA6B: designators end in D#6; ports VCCIO=IL68.VIOLR_FPGA30
FPGA31/FPGA6B: designators end in E#6; ports VCCIO=IL68.VIOLR_FPGA31
FPGA32/FPGA6B: designators end in F#6; ports VCCIO=IL68.VIOLR_FPGA32
FPGA33/FPGA6B: designators end in G#6; ports VCCIO=IL68.VIOLR_FPGA33
FPGA10/FPGA6B: designators end in H#6; ports VCCIO=IL68.VIOLR_FPGA10
FPGA11/FPGA6B: designators end in I#6; ports VCCIO=IL68.VIOLR_FPGA11
FPGA12/FPGA6B: designators end in J#6; ports VCCIO=IL68.VIOLR_FPGA12
FPGA13/FPGA6B: designators end in K#6; ports VCCIO=IL68.VIOLR_FPGA13
FPGA20/FPGA6B: designators end in L#6; ports VCCIO=IL68.VIOLR_FPGA20
FPGA21/FPGA6B: designators end in M#6; ports VCCIO=IL68.VIOLR_FPGA21
FPGA22/FPGA6B: designators end in N#6; ports VCCIO=IL68.VIOLR_FPGA22
FPGA23/FPGA6B: designators end in O#6; ports VCCIO=IL68.VIOLR_FPGA23
CFG/FPGA6B: designators end in P#6; ports VCCIO=IL68.VIOLR_CFG
FPGA00/FPGA6B: designators end in Q#6; ports VCCIO=IL68.VIOLR_FPGA00

### Buses and harness runs
harness G13 = port G13
harness LR = port LR

### Notes on the sheet
- (near U1) Left Bottom (W-SW)
- (near U1) Lattice ECP5 FPGA
- Title
- Engineer
- Revision
- Drawn By
- Checked By
- Date
- Sheet
- of
- (in symbol LFE5U_-85F-_BG756_, part J) BANK 6; DQ53; DQ65
- (in symbol LFE5U_-85F-_BG756_, part K) BANK 6; DQ77; DQ89

### Library data of the parts
U1 = LFE5U_-85F-_BG756_: as U1 on sheet fpga-bank1; Manufacturer P/N: LFE5U_-85F-_BG756_

## Sheet fpga-bank7.SchDoc: Copper Suicide - FPGA - Bank 7
size Letter; CheckedBy: J. Brinton; CompanyName: Signal Laboratories, Inc.; DrawnBy: J. Brinton; Engineer: J. Brinton; Address1: 3479 Edison Way; Address2: Menlo Park CA 94025; Address3: +1 (877) 778-8435; Address4: siglabs.com; Revision: 3; SheetNumber: 11; SheetTotal: 47
Used 17 times, as channels FPGA01/FPGA7B, FPGA02/FPGA7B, FPGA03/FPGA7B, FPGA30/FPGA7B, FPGA31/FPGA7B, FPGA32/FPGA7B, FPGA33/FPGA7B, FPGA10/FPGA7B, FPGA11/FPGA7B, FPGA12/FPGA7B, FPGA13/FPGA7B, FPGA20/FPGA7B, FPGA21/FPGA7B, FPGA22/FPGA7B, FPGA23/FPGA7B, CFG/FPGA7B, FPGA00/FPGA7B. Parts and nets are listed once, with the designators drawn on the sheet.
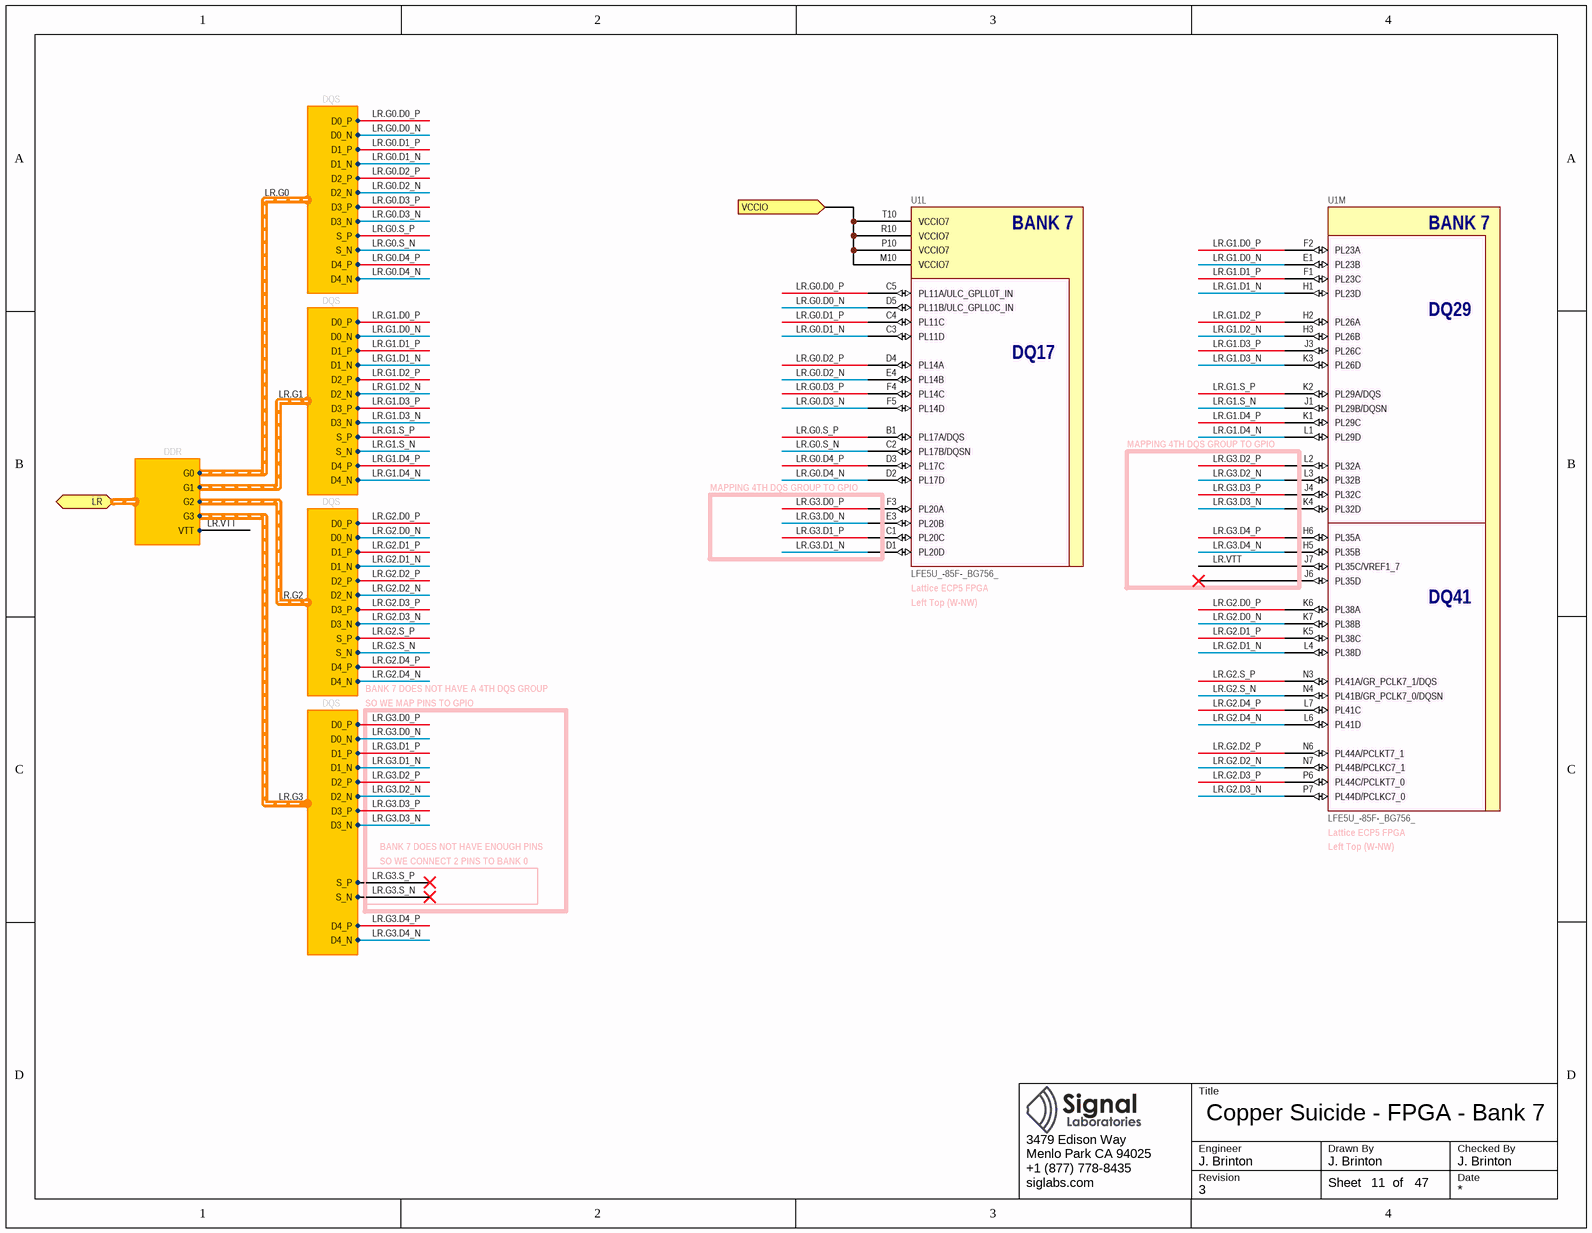
[diagram p8: fpga-bank7.SchDoc]

### Parts
U1  LFE5U_-85F-_BG756_  [caBGA756]  (parts L,M of 19)

### Ports
LR (harness DDR), VCCIO (in)

### Harnesses
DQS: D0_P, D0_N, D1_P, D1_N, D2_P, D2_N, D3_P, D3_N, D4_P, D4_N, S_P, S_N
DDR: G0, G1, G2, G3, VTT

### Nets
LR.G0.D0_N: U1.D5(PL11B/ULC_GPLL0C_IN) ; harness DQS.D0_N
LR.G0.D0_P: U1.C5(PL11A/ULC_GPLL0T_IN) ; harness DQS.D0_P
LR.G0.D1_N: U1.C3(PL11D) ; harness DQS.D1_N
LR.G0.D1_P: U1.C4(PL11C) ; harness DQS.D1_P
LR.G0.D2_N: U1.E4(PL14B) ; harness DQS.D2_N
LR.G0.D2_P: U1.D4(PL14A) ; harness DQS.D2_P
LR.G0.D3_N: U1.F5(PL14D) ; harness DQS.D3_N
LR.G0.D3_P: U1.F4(PL14C) ; harness DQS.D3_P
LR.G0.D4_N: U1.D2(PL17D) ; harness DQS.D4_N
LR.G0.D4_P: U1.D3(PL17C) ; harness DQS.D4_P
LR.G0.S_N: U1.C2(PL17B/DQSN) ; harness DQS.S_N
LR.G0.S_P: U1.B1(PL17A/DQS) ; harness DQS.S_P
LR.G1.D0_N: U1.E1(PL23B) ; harness DQS.D0_N
LR.G1.D0_P: U1.F2(PL23A) ; harness DQS.D0_P
LR.G1.D1_N: U1.H1(PL23D) ; harness DQS.D1_N
LR.G1.D1_P: U1.F1(PL23C) ; harness DQS.D1_P
LR.G1.D2_N: U1.H3(PL26B) ; harness DQS.D2_N
LR.G1.D2_P: U1.H2(PL26A) ; harness DQS.D2_P
LR.G1.D3_N: U1.K3(PL26D) ; harness DQS.D3_N
LR.G1.D3_P: U1.J3(PL26C) ; harness DQS.D3_P
LR.G1.D4_N: U1.L1(PL29D) ; harness DQS.D4_N
LR.G1.D4_P: U1.K1(PL29C) ; harness DQS.D4_P
LR.G1.S_N: U1.J1(PL29B/DQSN) ; harness DQS.S_N
LR.G1.S_P: U1.K2(PL29A/DQS) ; harness DQS.S_P
LR.G2.D0_N: U1.K7(PL38B) ; harness DQS.D0_N
LR.G2.D0_P: U1.K6(PL38A) ; harness DQS.D0_P
LR.G2.D1_N: U1.L4(PL38D) ; harness DQS.D1_N
LR.G2.D1_P: U1.K5(PL38C) ; harness DQS.D1_P
LR.G2.D2_N: U1.N7(PL44B/PCLKC7_1) ; harness DQS.D2_N
LR.G2.D2_P: U1.N6(PL44A/PCLKT7_1) ; harness DQS.D2_P
LR.G2.D3_N: U1.P7(PL44D/PCLKC7_0) ; harness DQS.D3_N
LR.G2.D3_P: U1.P6(PL44C/PCLKT7_0) ; harness DQS.D3_P
LR.G2.D4_N: U1.L6(PL41D) ; harness DQS.D4_N
LR.G2.D4_P: U1.L7(PL41C) ; harness DQS.D4_P
LR.G2.S_N: U1.N4(PL41B/GR_PCLK7_0/DQSN) ; harness DQS.S_N
LR.G2.S_P: U1.N3(PL41A/GR_PCLK7_1/DQS) ; harness DQS.S_P
LR.G3.D0_N: U1.E3(PL20B) ; harness DQS.D0_N
LR.G3.D0_P: U1.F3(PL20A) ; harness DQS.D0_P
LR.G3.D1_N: U1.D1(PL20D) ; harness DQS.D1_N
LR.G3.D1_P: U1.C1(PL20C) ; harness DQS.D1_P
LR.G3.D2_N: U1.L3(PL32B) ; harness DQS.D2_N
LR.G3.D2_P: U1.L2(PL32A) ; harness DQS.D2_P
LR.G3.D3_N: U1.K4(PL32D) ; harness DQS.D3_N
LR.G3.D3_P: U1.J4(PL32C) ; harness DQS.D3_P
LR.G3.D4_N: U1.H5(PL35B) ; harness DQS.D4_N
LR.G3.D4_P: U1.H6(PL35A) ; harness DQS.D4_P
LR.G3.S_N: harness DQS.S_N
LR.G3.S_P: harness DQS.S_P
LR.VTT: U1.J7(PL35C/VREF1_7) ; port LR.VTT
VCCIO: U1.M10(VCCIO7) U1.P10(VCCIO7) U1.R10(VCCIO7) U1.T10(VCCIO7) ; port VCCIO

Not connected (* = marked no-connect by the designer): U1 J6(PL35D)*

### Channels
FPGA01/FPGA7B: designators end in A#7; ports VCCIO=IL07.VIOLR_FPGA01
FPGA02/FPGA7B: designators end in B#7; ports VCCIO=IL07.VIOLR_FPGA02
FPGA03/FPGA7B: designators end in C#7; ports VCCIO=IL07.VIOLR_FPGA03
FPGA30/FPGA7B: designators end in D#7; ports VCCIO=IL07.VIOLR_FPGA30
FPGA31/FPGA7B: designators end in E#7; ports VCCIO=IL07.VIOLR_FPGA31
FPGA32/FPGA7B: designators end in F#7; ports VCCIO=IL07.VIOLR_FPGA32
FPGA33/FPGA7B: designators end in G#7; ports VCCIO=IL07.VIOLR_FPGA33
FPGA10/FPGA7B: designators end in H#7; ports VCCIO=IL07.VIOLR_FPGA10
FPGA11/FPGA7B: designators end in I#7; ports VCCIO=IL07.VIOLR_FPGA11
FPGA12/FPGA7B: designators end in J#7; ports VCCIO=IL07.VIOLR_FPGA12
FPGA13/FPGA7B: designators end in K#7; ports VCCIO=IL07.VIOLR_FPGA13
FPGA20/FPGA7B: designators end in L#7; ports VCCIO=IL07.VIOLR_FPGA20
FPGA21/FPGA7B: designators end in M#7; ports VCCIO=IL07.VIOLR_FPGA21
FPGA22/FPGA7B: designators end in N#7; ports VCCIO=IL07.VIOLR_FPGA22
FPGA23/FPGA7B: designators end in O#7; ports VCCIO=IL07.VIOLR_FPGA23
CFG/FPGA7B: designators end in P#7; ports VCCIO=IL07.VIOLR_CFG
FPGA00/FPGA7B: designators end in Q#7; ports VCCIO=IL07.VIOLR_FPGA00

### Notes on the sheet
- (near U1) MAPPING 4TH DQS GROUP TO GPIO
- (near U1) Left Top (W-NW)
- (near U1) Lattice ECP5 FPGA
- BANK 7 DOES NOT HAVE A 4TH DQS GROUP
- SO WE MAP PINS TO GPIO
- BANK 7 DOES NOT HAVE ENOUGH PINS
- SO WE CONNECT 2 PINS TO BANK 0
- Title
- Engineer
- Revision
- Drawn By
- Checked By
- Date
- Sheet
- of
- (in symbol LFE5U_-85F-_BG756_, part L) BANK 7; DQ17
- (in symbol LFE5U_-85F-_BG756_, part M) BANK 7; DQ29; DQ41

### Library data of the parts
U1 = LFE5U_-85F-_BG756_: as U1 on sheet fpga-bank1; Manufacturer P/N: LFE5U_-85F-_BG756_

## Sheet fpga-bank8.SchDoc: CS - FPGA - Bank 8
size Letter; CheckedBy: J. Brinton; CompanyName: Signal Laboratories, Inc.; DrawnBy: J. Brinton; Engineer: J. Brinton; Address1: 3479 Edison Way; Address2: Menlo Park CA 94025; Address3: +1 (877) 778-8435; Address4: siglabs.com; Revision: 3; SheetNumber: 12; SheetTotal: 47
Used 17 times, as channels FPGA01/FPGA8B, FPGA02/FPGA8B, FPGA03/FPGA8B, FPGA30/FPGA8B, FPGA31/FPGA8B, FPGA32/FPGA8B, FPGA33/FPGA8B, FPGA10/FPGA8B, FPGA11/FPGA8B, FPGA12/FPGA8B, FPGA13/FPGA8B, FPGA20/FPGA8B, FPGA21/FPGA8B, FPGA22/FPGA8B, FPGA23/FPGA8B, CFG/FPGA8B, FPGA00/FPGA8B. Parts and nets are listed once, with the designators drawn on the sheet.
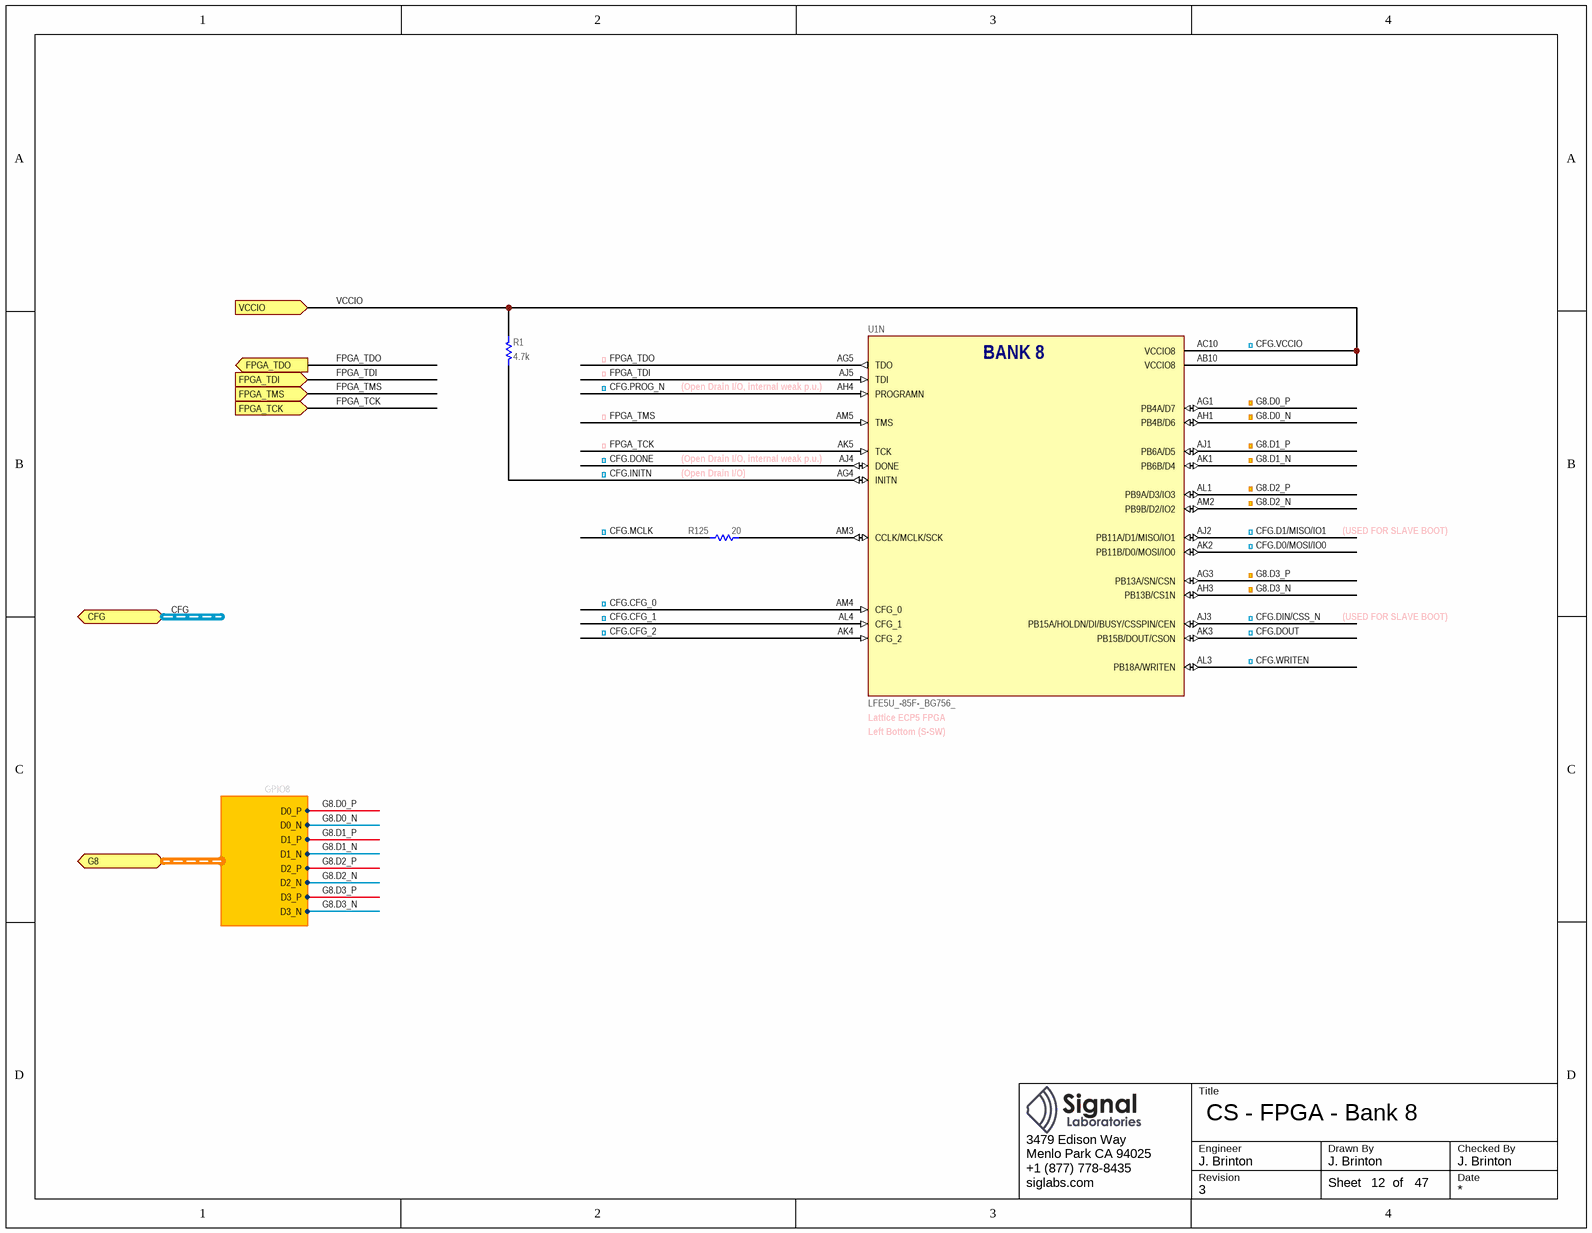
[diagram p9: fpga-bank8.SchDoc]

### Parts
R1  value 4.7k  [RESC1005X40N]  (hidden comment: ERJ-2RKF4701X)
R125  value 20  [RESC1005X40N]  (hidden comment: ERJ-2RKF20R0X)
U1  LFE5U_-85F-_BG756_  [caBGA756]  (part N of 19)

### Ports
CFG (harness CFG), FPGA_TCK (in), FPGA_TDI (in), FPGA_TDO (out), FPGA_TMS (in), G8 (harness GPIO8), VCCIO (in)

### Harnesses
GPIO8: D0_P, D0_N, D1_P, D1_N, D2_P, D2_N, D3_P, D3_N

### Nets
CFG.CFG_0: U1.AM4(CFG_0)
CFG.CFG_1: U1.AL4(CFG_1)
CFG.CFG_2: U1.AK4(CFG_2)
CFG.D0/MOSI/IO0: U1.AK2(PB11B/D0/MOSI/IO0)
CFG.D1/MISO/IO1: U1.AJ2(PB11A/D1/MISO/IO1)
CFG.DIN/CSS_N: U1.AJ3(PB15A/HOLDN/DI/BUSY/CSSPIN/CEN)
CFG.DONE: U1.AJ4(DONE)
CFG.DOUT: U1.AK3(PB15B/DOUT/CSON)
CFG.INITN: R1.1 U1.AG4(INITN)
CFG.MCLK: R125.1
CFG.PROG_N: U1.AH4(PROGRAMN)
CFG.VCCIO: R1.2 U1.AB10(VCCIO8) U1.AC10(VCCIO8) ; port VCCIO  [also labelled VCCIO]
CFG.WRITEN: U1.AL3(PB18A/WRITEN)
FPGA_TCK: U1.AK5(TCK) ; port FPGA_TCK
FPGA_TDI: U1.AJ5(TDI) ; port FPGA_TDI
FPGA_TDO: U1.AG5(TDO) ; port FPGA_TDO
FPGA_TMS: U1.AM5(TMS) ; port FPGA_TMS
G8.D0_N: U1.AH1(PB4B/D6) ; port G8.D0_N
G8.D0_P: U1.AG1(PB4A/D7) ; port G8.D0_P
G8.D1_N: U1.AK1(PB6B/D4) ; port G8.D1_N
G8.D1_P: U1.AJ1(PB6A/D5) ; port G8.D1_P
G8.D2_N: U1.AM2(PB9B/D2/IO2) ; port G8.D2_N
G8.D2_P: U1.AL1(PB9A/D3/IO3) ; port G8.D2_P
G8.D3_N: U1.AH3(PB13B/CS1N) ; port G8.D3_N
G8.D3_P: U1.AG3(PB13A/SN/CSN) ; port G8.D3_P
NetR125_2: R125.2 U1.AM3(CCLK/MCLK/SCK)

### Channels
FPGA01/FPGA8B: designators R1=R1A R125=R125A U1=U1A#8; ports FPGA_TCK=FPGA_TCK_FPGA01 FPGA_TDI=FPGA_TDI_FPGA01 FPGA_TDO=FPGA_TDO_FPGA01 FPGA_TMS=FPGA_TMS_FPGA01 VCCIO=IL68.VIOTB_FPGA01
FPGA02/FPGA8B: designators R1=R1B R125=R125B U1=U1B#8; ports FPGA_TCK=FPGA_TCK_FPGA02 FPGA_TDI=FPGA_TDI_FPGA02 FPGA_TDO=FPGA_TDO_FPGA02 FPGA_TMS=FPGA_TMS_FPGA02 VCCIO=IL68.VIOTB_FPGA02
FPGA03/FPGA8B: designators R1=R1C R125=R125C U1=U1C#8; ports FPGA_TCK=FPGA_TCK_FPGA03 FPGA_TDI=FPGA_TDI_FPGA03 FPGA_TDO=FPGA_TDO_FPGA03 FPGA_TMS=FPGA_TMS_FPGA03 VCCIO=IL68.VIOTB_FPGA03
FPGA30/FPGA8B: designators R1=R1D R125=R125D U1=U1D#8; ports FPGA_TCK=FPGA_TCK_FPGA30 FPGA_TDI=FPGA_TDI_FPGA30 FPGA_TDO=FPGA_TDO_FPGA30 FPGA_TMS=FPGA_TMS_FPGA30 VCCIO=IL68.VIOTB_FPGA30
FPGA31/FPGA8B: designators R1=R1E R125=R125E U1=U1E#8; ports FPGA_TCK=FPGA_TCK_FPGA31 FPGA_TDI=FPGA_TDI_FPGA31 FPGA_TDO=FPGA_TDO_FPGA31 FPGA_TMS=FPGA_TMS_FPGA31 VCCIO=IL68.VIOTB_FPGA31
FPGA32/FPGA8B: designators R1=R1F R125=R125F U1=U1F#8; ports FPGA_TCK=FPGA_TCK_FPGA32 FPGA_TDI=FPGA_TDI_FPGA32 FPGA_TDO=FPGA_TDO_FPGA32 FPGA_TMS=FPGA_TMS_FPGA32 VCCIO=IL68.VIOTB_FPGA32
FPGA33/FPGA8B: designators R1=R1G R125=R125G U1=U1G#8; ports FPGA_TCK=FPGA_TCK_FPGA33 FPGA_TDI=FPGA_TDI_FPGA33 FPGA_TDO=FPGA_TDO_FPGA33 FPGA_TMS=FPGA_TMS_FPGA33 VCCIO=IL68.VIOTB_FPGA33
FPGA10/FPGA8B: designators R1=R1H R125=R125H U1=U1H#8; ports FPGA_TCK=FPGA_TCK_FPGA10 FPGA_TDI=FPGA_TDI_FPGA10 FPGA_TDO=FPGA_TDO_FPGA10 FPGA_TMS=FPGA_TMS_FPGA10 VCCIO=IL68.VIOTB_FPGA10
FPGA11/FPGA8B: designators R1=R1I R125=R125I U1=U1I#8; ports FPGA_TCK=FPGA_TCK_FPGA11 FPGA_TDI=FPGA_TDI_FPGA11 FPGA_TDO=FPGA_TDO_FPGA11 FPGA_TMS=FPGA_TMS_FPGA11 VCCIO=IL68.VIOTB_FPGA11
FPGA12/FPGA8B: designators R1=R1J R125=R125J U1=U1J#8; ports FPGA_TCK=FPGA_TCK_FPGA12 FPGA_TDI=FPGA_TDI_FPGA12 FPGA_TDO=FPGA_TDO_FPGA12 FPGA_TMS=FPGA_TMS_FPGA12 VCCIO=IL68.VIOTB_FPGA12
FPGA13/FPGA8B: designators R1=R1K R125=R125K U1=U1K#8; ports FPGA_TCK=FPGA_TCK_FPGA13 FPGA_TDI=FPGA_TDI_FPGA13 FPGA_TDO=FPGA_TDO_FPGA13 FPGA_TMS=FPGA_TMS_FPGA13 VCCIO=IL68.VIOTB_FPGA13
FPGA20/FPGA8B: designators R1=R1L R125=R125L U1=U1L#8; ports FPGA_TCK=FPGA_TCK_FPGA20 FPGA_TDI=FPGA_TDI_FPGA20 FPGA_TDO=FPGA_TDO_FPGA20 FPGA_TMS=FPGA_TMS_FPGA20 VCCIO=IL68.VIOTB_FPGA20
FPGA21/FPGA8B: designators R1=R1M R125=R125M U1=U1M#8; ports FPGA_TCK=FPGA_TCK_FPGA21 FPGA_TDI=FPGA_TDI_FPGA21 FPGA_TDO=FPGA_TDO_FPGA21 FPGA_TMS=FPGA_TMS_FPGA21 VCCIO=IL68.VIOTB_FPGA21
FPGA22/FPGA8B: designators R1=R1N R125=R125N U1=U1N#8; ports FPGA_TCK=FPGA_TCK_FPGA22 FPGA_TDI=FPGA_TDI_FPGA22 FPGA_TDO=FPGA_TDO_FPGA22 FPGA_TMS=FPGA_TMS_FPGA22 VCCIO=IL68.VIOTB_FPGA22
FPGA23/FPGA8B: designators R1=R1O R125=R125O U1=U1O#8; ports FPGA_TCK=FPGA_TCK_FPGA23 FPGA_TDI=FPGA_TDI_FPGA23 FPGA_TDO=FPGA_TDO_FPGA23 FPGA_TMS=FPGA_TMS_FPGA23 VCCIO=IL68.VIOTB_FPGA23
CFG/FPGA8B: designators R1=R1P R125=R125P U1=U1P#8; ports FPGA_TCK=FPGA_TCK_CFG FPGA_TDI=FPGA_TDI_CFG FPGA_TDO=FPGA_TDO_CFG FPGA_TMS=FPGA_TMS_CFG VCCIO=IL68.VIOTB_CFG
FPGA00/FPGA8B: designators R1=R1Q R125=R125Q U1=U1Q#8; ports FPGA_TCK=FPGA_TCK_FPGA00 FPGA_TDI=FPGA_TDI_FPGA00 FPGA_TDO=FPGA_TDO_FPGA00 FPGA_TMS=FPGA_TMS_FPGA00 VCCIO=IL68.VIOTB_FPGA00

### Buses and harness runs
harness CFG = port CFG

### Notes on the sheet
- (near U1) (Open Drain I/O, internal weak p.u.)
- (Open Drain I/O)
- (USED FOR SLAVE BOOT)
- Left Bottom (S-SW)
- (near U1) Lattice ECP5 FPGA
- Title
- Engineer
- Revision
- Drawn By
- Checked By
- Date
- Sheet
- of
- (in symbol LFE5U_-85F-_BG756_, part N) BANK 8

### Library data of the parts
R1 = RES: Thick Film Resistor 4.7k ±1% 0.1W 75V 0402; Manufacturer: Panasonic; Tcr: ±100; Tr: -55:155; Voltage: 75; Power: 0.1; Tolerance: ±1%; Manufacturer P/N: ERJ-2RKF4701X; Alternatives: *; Footprint: *; Package: 0402
R125 = RES: Thick Film Resistor 20 ±1% 0.1W 75V 0402; Manufacturer: Panasonic; Tcr: ±100; Tr: -55:155; Voltage: 75; Power: 0.1; Tolerance: ±1%; Manufacturer P/N: ERJ-2RKF20R0X; Alternatives: *; Footprint: *; Package: 0402
U1 = LFE5U_-85F-_BG756_: as U1 on sheet fpga-bank1; Manufacturer P/N: LFE5U_-85F-_BG756_

## Sheet fpga-ground.SchDoc: Copper Suicide - FPGA - Ground
size Letter; CheckedBy: J. Brinton; CompanyName: Signal Laboratories, Inc.; DrawnBy: J. Brinton; Engineer: J. Brinton; Address1: 3479 Edison Way; Address2: Menlo Park CA 94025; Address3: +1 (877) 778-8435; Address4: siglabs.com; Revision: 3; SheetNumber: 14; SheetTotal: 47
Used 17 times, as channels FPGA01/FPGAGND, FPGA02/FPGAGND, FPGA03/FPGAGND, FPGA30/FPGAGND, FPGA31/FPGAGND, FPGA32/FPGAGND, FPGA33/FPGAGND, FPGA10/FPGAGND, FPGA11/FPGAGND, FPGA12/FPGAGND, FPGA13/FPGAGND, FPGA20/FPGAGND, FPGA21/FPGAGND, FPGA22/FPGAGND, FPGA23/FPGAGND, CFG/FPGAGND, FPGA00/FPGAGND. Parts and nets are listed once, with the designators drawn on the sheet.
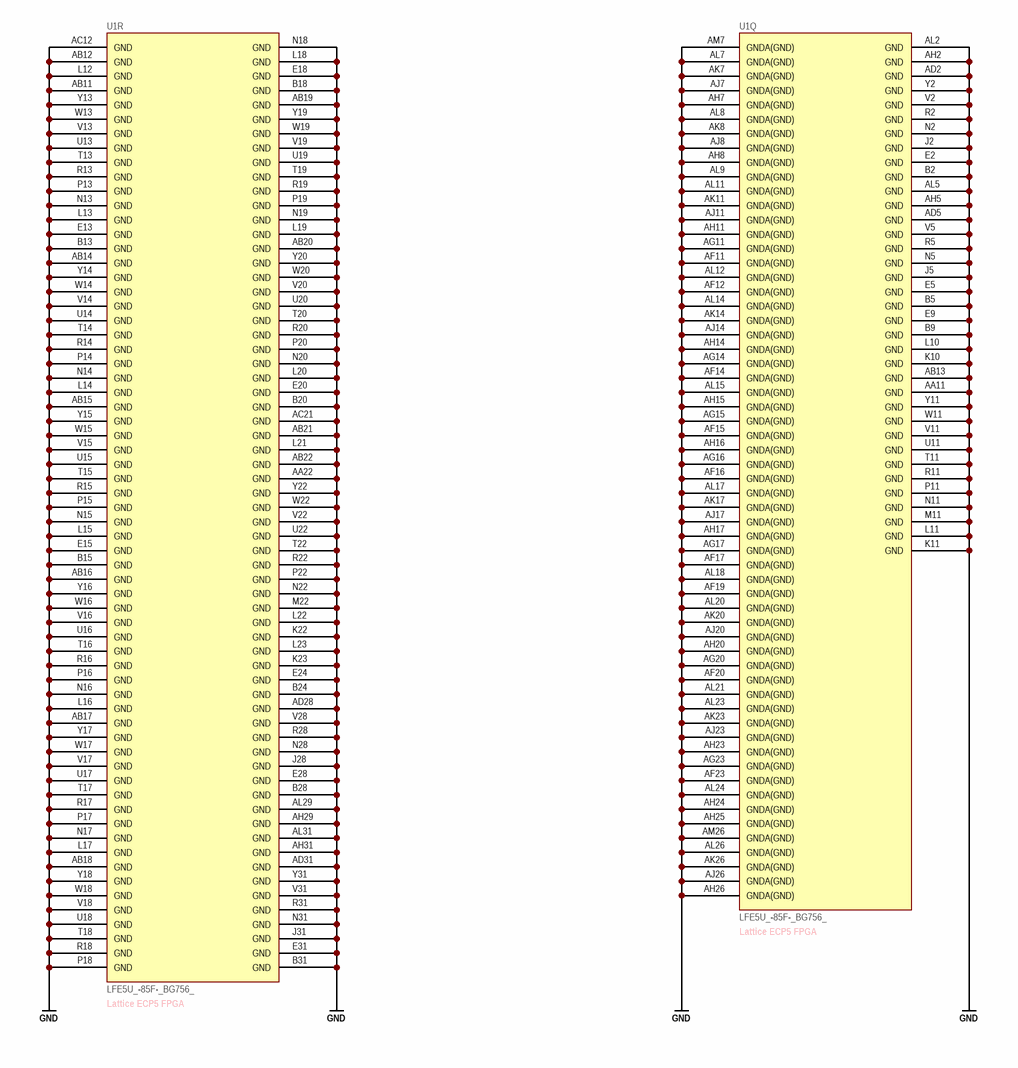
[diagram p10: fpga-ground.SchDoc]

### Parts
U1  LFE5U_-85F-_BG756_  [caBGA756]  (parts Q,R of 19)

### Nets
GND: U1.AA11(GND) U1.AA22(GND) U1.AB11(GND) U1.AB12(GND) U1.AB13(GND) U1.AB14(GND) U1.AB15(GND) U1.AB16(GND) U1.AB17(GND) U1.AB18(GND) U1.AB19(GND) U1.AB20(GND) U1.AB21(GND) U1.AB22(GND) U1.AC12(GND) U1.AC21(GND) U1.AD2(GND) U1.AD5(GND) U1.AD28(GND) U1.AD31(GND) U1.AF11(GNDA(GND)) U1.AF12(GNDA(GND)) U1.AF14(GNDA(GND)) U1.AF15(GNDA(GND)) U1.AF16(GNDA(GND)) U1.AF17(GNDA(GND)) U1.AF19(GNDA(GND)) U1.AF20(GNDA(GND)) U1.AF23(GNDA(GND)) U1.AG11(GNDA(GND)) U1.AG14(GNDA(GND)) U1.AG15(GNDA(GND)) U1.AG16(GNDA(GND)) U1.AG17(GNDA(GND)) U1.AG20(GNDA(GND)) U1.AG23(GNDA(GND)) U1.AH2(GND) U1.AH5(GND) U1.AH7(GNDA(GND)) U1.AH8(GNDA(GND)) U1.AH11(GNDA(GND)) U1.AH14(GNDA(GND)) U1.AH15(GNDA(GND)) U1.AH16(GNDA(GND)) U1.AH17(GNDA(GND)) U1.AH20(GNDA(GND)) U1.AH23(GNDA(GND)) U1.AH24(GNDA(GND)) U1.AH25(GNDA(GND)) U1.AH26(GNDA(GND)) U1.AH29(GND) U1.AH31(GND) U1.AJ7(GNDA(GND)) U1.AJ8(GNDA(GND)) U1.AJ11(GNDA(GND)) U1.AJ14(GNDA(GND)) U1.AJ17(GNDA(GND)) U1.AJ20(GNDA(GND)) U1.AJ23(GNDA(GND)) U1.AJ26(GNDA(GND)) U1.AK7(GNDA(GND)) U1.AK8(GNDA(GND)) U1.AK11(GNDA(GND)) U1.AK14(GNDA(GND)) U1.AK17(GNDA(GND)) U1.AK20(GNDA(GND)) U1.AK23(GNDA(GND)) U1.AK26(GNDA(GND)) U1.AL2(GND) U1.AL5(GND) U1.AL7(GNDA(GND)) U1.AL8(GNDA(GND)) U1.AL9(GNDA(GND)) U1.AL11(GNDA(GND)) U1.AL12(GNDA(GND)) U1.AL14(GNDA(GND)) U1.AL15(GNDA(GND)) U1.AL17(GNDA(GND)) U1.AL18(GNDA(GND)) U1.AL20(GNDA(GND)) U1.AL21(GNDA(GND)) U1.AL23(GNDA(GND)) U1.AL24(GNDA(GND)) U1.AL26(GNDA(GND)) U1.AL29(GND) U1.AL31(GND) U1.AM7(GNDA(GND)) U1.AM26(GNDA(GND)) U1.B2(GND) U1.B5(GND) U1.B9(GND) U1.B13(GND) U1.B15(GND) U1.B18(GND) U1.B20(GND) U1.B24(GND) U1.B28(GND) U1.B31(GND) U1.E2(GND) U1.E5(GND) U1.E9(GND) U1.E13(GND) U1.E15(GND) U1.E18(GND) U1.E20(GND) U1.E24(GND) U1.E28(GND) U1.E31(GND) U1.J2(GND) U1.J5(GND) U1.J28(GND) U1.J31(GND) U1.K10(GND) U1.K11(GND) U1.K22(GND) U1.K23(GND) U1.L10(GND) U1.L11(GND) U1.L12(GND) U1.L13(GND) U1.L14(GND) U1.L15(GND) U1.L16(GND) U1.L17(GND) U1.L18(GND) U1.L19(GND) U1.L20(GND) U1.L21(GND) U1.L22(GND) U1.L23(GND) U1.M11(GND) U1.M22(GND) U1.N2(GND) U1.N5(GND) U1.N11(GND) U1.N13(GND) U1.N14(GND) U1.N15(GND) U1.N16(GND) U1.N17(GND) U1.N18(GND) U1.N19(GND) U1.N20(GND) U1.N22(GND) U1.N28(GND) U1.N31(GND) U1.P11(GND) U1.P13(GND) U1.P14(GND) U1.P15(GND) U1.P16(GND) U1.P17(GND) U1.P18(GND) U1.P19(GND) U1.P20(GND) U1.P22(GND) U1.R2(GND) U1.R5(GND) U1.R11(GND) U1.R13(GND) U1.R14(GND) U1.R15(GND) U1.R16(GND) U1.R17(GND) U1.R18(GND) U1.R19(GND) U1.R20(GND) U1.R22(GND) U1.R28(GND) U1.R31(GND) U1.T11(GND) U1.T13(GND) U1.T14(GND) U1.T15(GND) U1.T16(GND) U1.T17(GND) U1.T18(GND) U1.T19(GND) U1.T20(GND) U1.T22(GND) U1.U11(GND) U1.U13(GND) U1.U14(GND) U1.U15(GND) U1.U16(GND) U1.U17(GND) U1.U18(GND) U1.U19(GND) U1.U20(GND) U1.U22(GND) U1.V2(GND) U1.V5(GND) U1.V11(GND) U1.V13(GND) U1.V14(GND) U1.V15(GND) U1.V16(GND) U1.V17(GND) U1.V18(GND) U1.V19(GND) U1.V20(GND) U1.V22(GND) U1.V28(GND) U1.V31(GND) U1.W11(GND) U1.W13(GND) U1.W14(GND) U1.W15(GND) U1.W16(GND) U1.W17(GND) U1.W18(GND) U1.W19(GND) U1.W20(GND) U1.W22(GND) U1.Y2(GND) U1.Y11(GND) U1.Y13(GND) U1.Y14(GND) U1.Y15(GND) U1.Y16(GND) U1.Y17(GND) U1.Y18(GND) U1.Y19(GND) U1.Y20(GND) U1.Y22(GND) U1.Y31(GND)

### Channels
FPGA01/FPGAGND: designators end in A#9
FPGA02/FPGAGND: designators end in B#9
FPGA03/FPGAGND: designators end in C#9
FPGA30/FPGAGND: designators end in D#9
FPGA31/FPGAGND: designators end in E#9
FPGA32/FPGAGND: designators end in F#9
FPGA33/FPGAGND: designators end in G#9
FPGA10/FPGAGND: designators end in H#9
FPGA11/FPGAGND: designators end in I#9
FPGA12/FPGAGND: designators end in J#9
FPGA13/FPGAGND: designators end in K#9
FPGA20/FPGAGND: designators end in L#9
FPGA21/FPGAGND: designators end in M#9
FPGA22/FPGAGND: designators end in N#9
FPGA23/FPGAGND: designators end in O#9
CFG/FPGAGND: designators end in P#9
FPGA00/FPGAGND: designators end in Q#9

### Notes on the sheet
- (near U1) Lattice ECP5 FPGA
- Title
- Engineer
- Revision
- Drawn By
- Checked By
- Date
- Sheet
- of

### Library data of the parts
U1 = LFE5U_-85F-_BG756_: as U1 on sheet fpga-bank1; Manufacturer P/N: LFE5U_-85F-_BG756_

## Sheet fpga-misc.SchDoc: Copper Suicide - FPGA - Misc
size Letter; CheckedBy: J. Brinton; CompanyName: Signal Laboratories, Inc.; DrawnBy: J. Brinton; Engineer: J. Brinton; Address1: 3479 Edison Way; Address2: Menlo Park CA 94025; Address3: +1 (877) 778-8435; Address4: siglabs.com; Revision: 3; SheetNumber: 15; SheetTotal: 47
Used 17 times, as channels FPGA01/FPGAMISC, FPGA02/FPGAMISC, FPGA03/FPGAMISC, FPGA30/FPGAMISC, FPGA31/FPGAMISC, FPGA32/FPGAMISC, FPGA33/FPGAMISC, FPGA10/FPGAMISC, FPGA11/FPGAMISC, FPGA12/FPGAMISC, FPGA13/FPGAMISC, FPGA20/FPGAMISC, FPGA21/FPGAMISC, FPGA22/FPGAMISC, FPGA23/FPGAMISC, CFG/FPGAMISC, FPGA00/FPGAMISC. Parts and nets are listed once, with the designators drawn on the sheet.
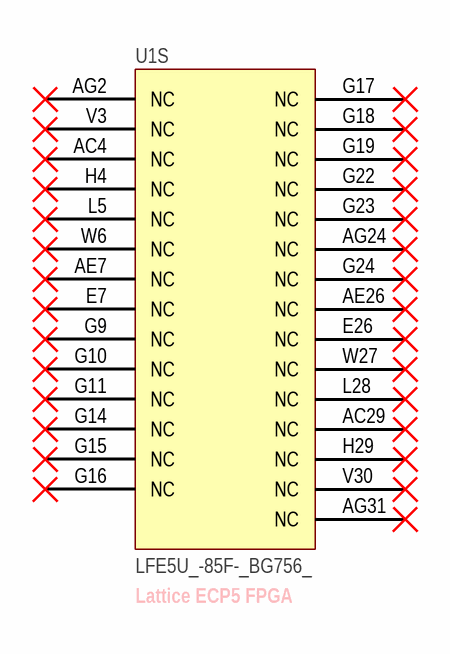
[diagram p11: fpga-misc.SchDoc]

### Parts
U1  LFE5U_-85F-_BG756_  [caBGA756]  (part S of 19)

### Nets

Not connected (* = marked no-connect by the designer): U1 AC4(NC)* AC29(NC)* AE7(NC)* AE26(NC)* AG2(NC)* AG24(NC)* AG31(NC)* E7(NC)* E26(NC)* G9(NC)* G10(NC)* G11(NC)* G14(NC)* G15(NC)* G16(NC)* G17(NC)* G18(NC)* G19(NC)* G22(NC)* G23(NC)* G24(NC)* H4(NC)* H29(NC)* L5(NC)* L28(NC)* V3(NC)* V30(NC)* W6(NC)* W27(NC)*

### Channels
FPGA01/FPGAMISC: designators end in A#10
FPGA02/FPGAMISC: designators end in B#10
FPGA03/FPGAMISC: designators end in C#10
FPGA30/FPGAMISC: designators end in D#10
FPGA31/FPGAMISC: designators end in E#10
FPGA32/FPGAMISC: designators end in F#10
FPGA33/FPGAMISC: designators end in G#10
FPGA10/FPGAMISC: designators end in H#10
FPGA11/FPGAMISC: designators end in I#10
FPGA12/FPGAMISC: designators end in J#10
FPGA13/FPGAMISC: designators end in K#10
FPGA20/FPGAMISC: designators end in L#10
FPGA21/FPGAMISC: designators end in M#10
FPGA22/FPGAMISC: designators end in N#10
FPGA23/FPGAMISC: designators end in O#10
CFG/FPGAMISC: designators end in P#10
FPGA00/FPGAMISC: designators end in Q#10

### Notes on the sheet
- (near U1) Lattice ECP5 FPGA
- Title
- Engineer
- Revision
- Drawn By
- Checked By
- Date
- Sheet
- of

### Library data of the parts
U1 = LFE5U_-85F-_BG756_: as U1 on sheet fpga-bank1; Manufacturer P/N: LFE5U_-85F-_BG756_

## Sheet fpga-serdes.SchDoc: Copper Suicide - FPGA - SERDES
size Letter; CheckedBy: J. Brinton; CompanyName: Signal Laboratories, Inc.; DrawnBy: J. Brinton; Engineer: J. Brinton; Address1: 3479 Edison Way; Address2: Menlo Park CA 94025; Address3: +1 (877) 778-8435; Address4: siglabs.com; Revision: 3; SheetNumber: 16; SheetTotal: 47
Used 17 times, as channels FPGA01/FPGASERDES, FPGA02/FPGASERDES, FPGA03/FPGASERDES, FPGA30/FPGASERDES, FPGA31/FPGASERDES, FPGA32/FPGASERDES, FPGA33/FPGASERDES, FPGA10/FPGASERDES, FPGA11/FPGASERDES, FPGA12/FPGASERDES, FPGA13/FPGASERDES, FPGA20/FPGASERDES, FPGA21/FPGASERDES, FPGA22/FPGASERDES, FPGA23/FPGASERDES, CFG/FPGASERDES, FPGA00/FPGASERDES. Parts and nets are listed once, with the designators drawn on the sheet.
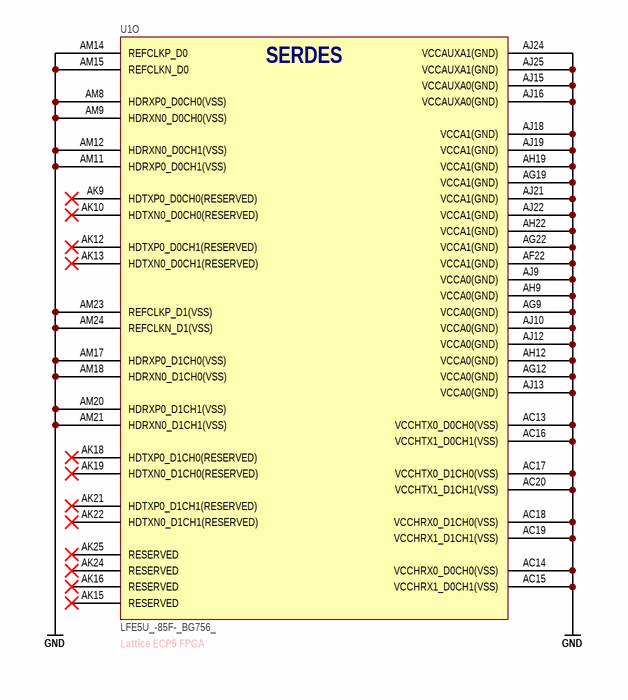
[diagram p12: fpga-serdes.SchDoc]

### Parts
U1  LFE5U_-85F-_BG756_  [caBGA756]  (part O of 19)

### Nets
GND: U1.AC13(VCCHTX0_D0CH0(VSS)) U1.AC14(VCCHRX0_D0CH0(VSS)) U1.AC15(VCCHRX1_D0CH1(VSS)) U1.AC16(VCCHTX1_D0CH1(VSS)) U1.AC17(VCCHTX0_D1CH0(VSS)) U1.AC18(VCCHRX0_D1CH0(VSS)) U1.AC19(VCCHRX1_D1CH1(VSS)) U1.AC20(VCCHTX1_D1CH1(VSS)) U1.AF22(VCCA1(GND)) U1.AG9(VCCA0(GND)) U1.AG12(VCCA0(GND)) U1.AG19(VCCA1(GND)) U1.AG22(VCCA1(GND)) U1.AH9(VCCA0(GND)) U1.AH12(VCCA0(GND)) U1.AH19(VCCA1(GND)) U1.AH22(VCCA1(GND)) U1.AJ9(VCCA0(GND)) U1.AJ10(VCCA0(GND)) U1.AJ12(VCCA0(GND)) U1.AJ13(VCCA0(GND)) U1.AJ15(VCCAUXA0(GND)) U1.AJ16(VCCAUXA0(GND)) U1.AJ18(VCCA1(GND)) U1.AJ19(VCCA1(GND)) U1.AJ21(VCCA1(GND)) U1.AJ22(VCCA1(GND)) U1.AJ24(VCCAUXA1(GND)) U1.AJ25(VCCAUXA1(GND)) U1.AM8(HDRXP0_D0CH0(VSS)) U1.AM9(HDRXN0_D0CH0(VSS)) U1.AM11(HDRXP0_D0CH1(VSS)) U1.AM12(HDRXN0_D0CH1(VSS)) U1.AM14(REFCLKP_D0) U1.AM15(REFCLKN_D0) U1.AM17(HDRXP0_D1CH0(VSS)) U1.AM18(HDRXN0_D1CH0(VSS)) U1.AM20(HDRXP0_D1CH1(VSS)) U1.AM21(HDRXN0_D1CH1(VSS)) U1.AM23(REFCLKP_D1(VSS)) U1.AM24(REFCLKN_D1(VSS))

Not connected (* = marked no-connect by the designer): U1 AK9(HDTXP0_D0CH0(RESERVED))* AK10(HDTXN0_D0CH0(RESERVED))* AK12(HDTXP0_D0CH1(RESERVED))* AK13(HDTXN0_D0CH1(RESERVED))* AK15(RESERVED)* AK16(RESERVED)* AK18(HDTXP0_D1CH0(RESERVED))* AK19(HDTXN0_D1CH0(RESERVED))* AK21(HDTXP0_D1CH1(RESERVED))* AK22(HDTXN0_D1CH1(RESERVED))* AK24(RESERVED)* AK25(RESERVED)*

### Channels
FPGA01/FPGASERDES: designators end in A#11
FPGA02/FPGASERDES: designators end in B#11
FPGA03/FPGASERDES: designators end in C#11
FPGA30/FPGASERDES: designators end in D#11
FPGA31/FPGASERDES: designators end in E#11
FPGA32/FPGASERDES: designators end in F#11
FPGA33/FPGASERDES: designators end in G#11
FPGA10/FPGASERDES: designators end in H#11
FPGA11/FPGASERDES: designators end in I#11
FPGA12/FPGASERDES: designators end in J#11
FPGA13/FPGASERDES: designators end in K#11
FPGA20/FPGASERDES: designators end in L#11
FPGA21/FPGASERDES: designators end in M#11
FPGA22/FPGASERDES: designators end in N#11
FPGA23/FPGASERDES: designators end in O#11
CFG/FPGASERDES: designators end in P#11
FPGA00/FPGASERDES: designators end in Q#11

### Notes on the sheet
- (near U1) Lattice ECP5 FPGA
- Title
- Engineer
- Revision
- Drawn By
- Checked By
- Date
- Sheet
- of
- (in symbol LFE5U_-85F-_BG756_, part O) SERDES

### Library data of the parts
U1 = LFE5U_-85F-_BG756_: as U1 on sheet fpga-bank1; Manufacturer P/N: LFE5U_-85F-_BG756_